# EAGLE design flightComputer (EAGLE 5.09)
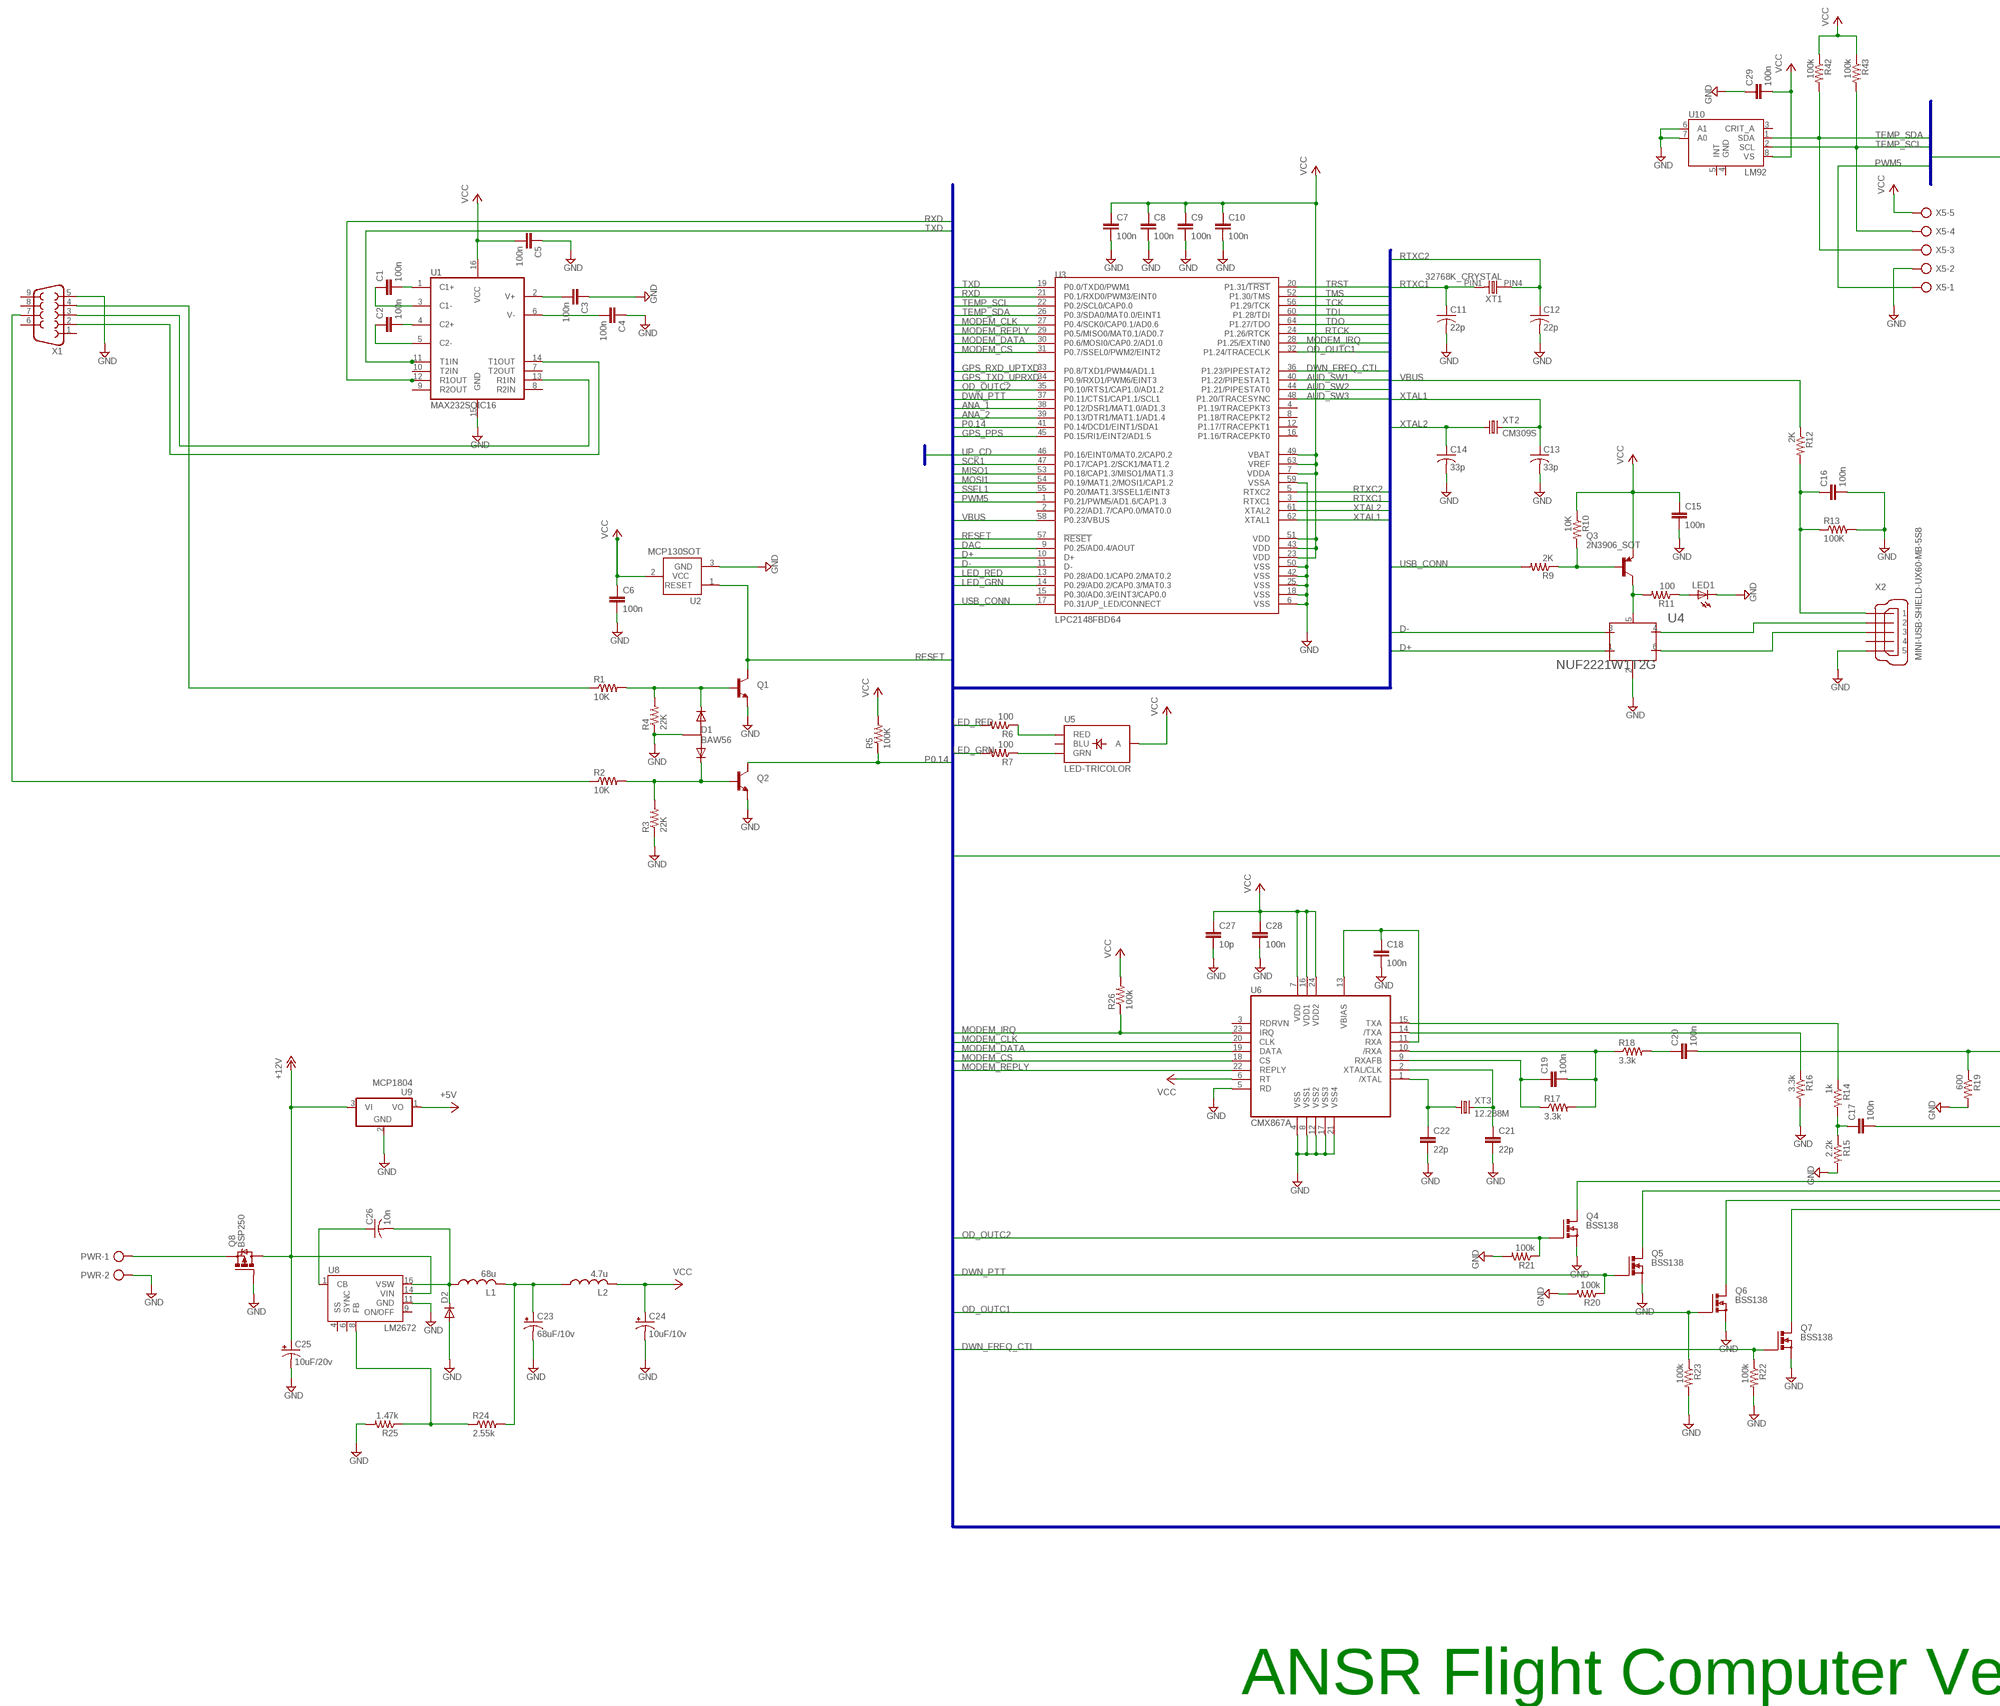
[diagram p0: schematic, sheet 1, part 1 of 2]
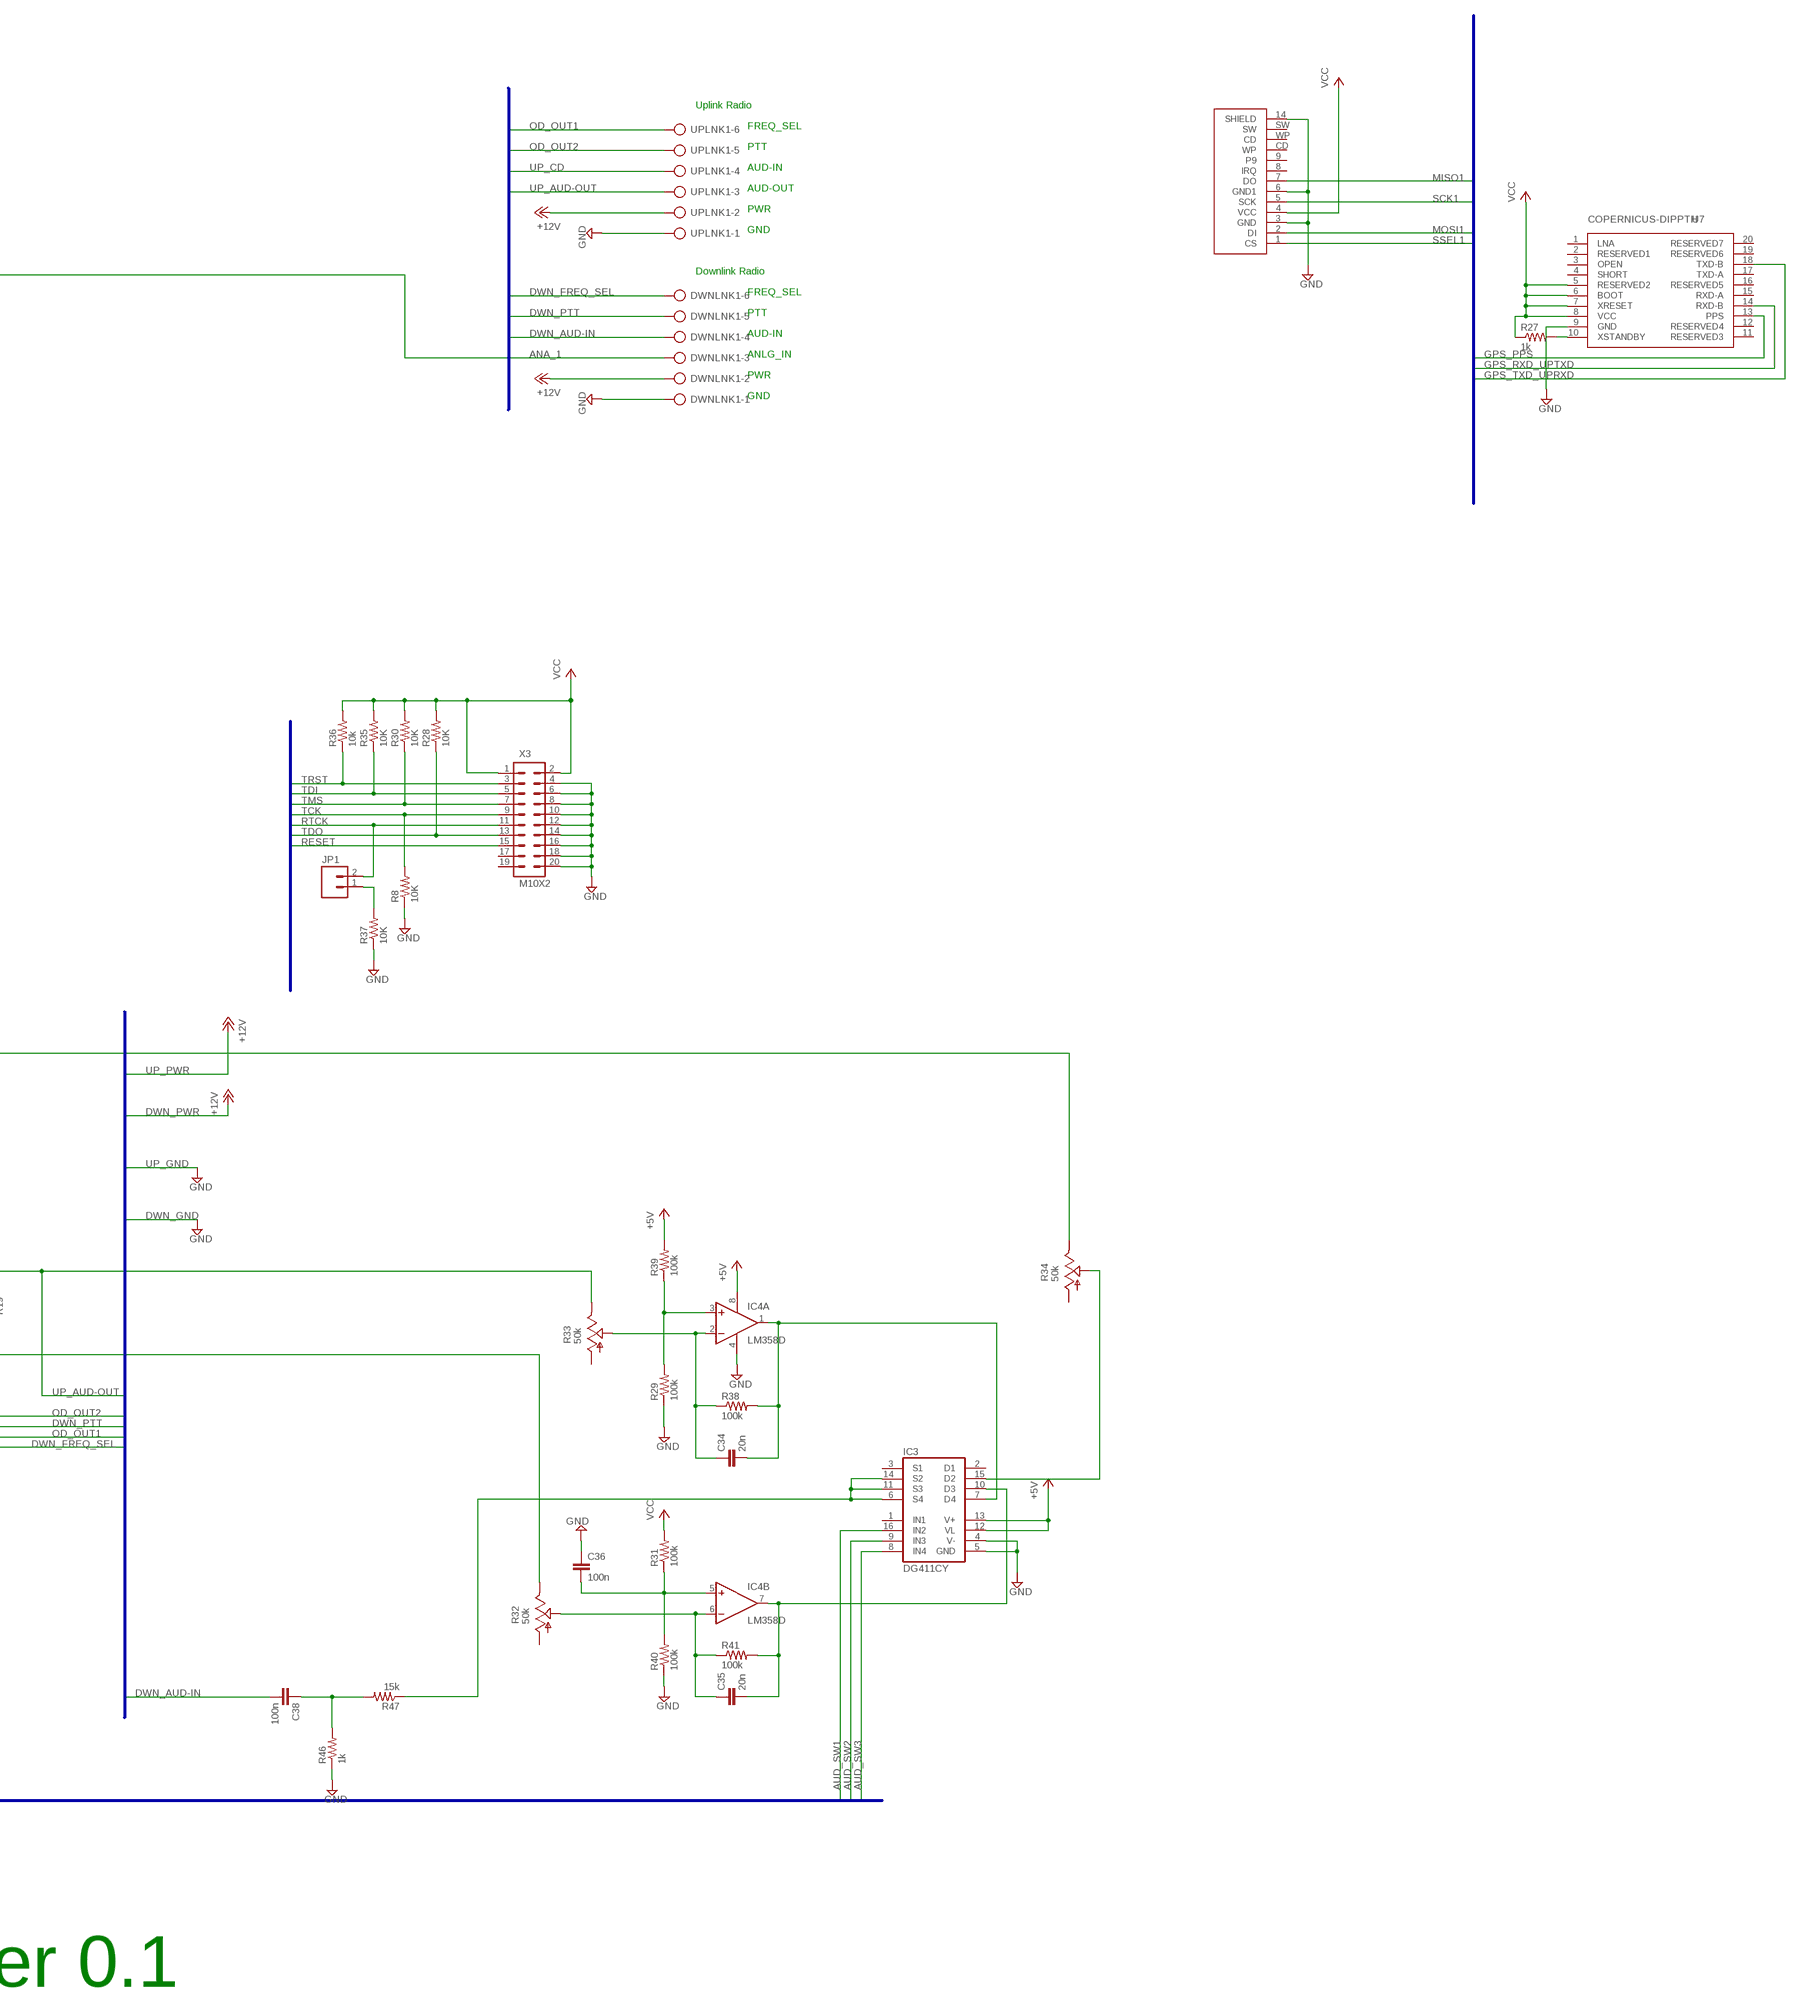
[diagram p1: schematic, sheet 1, part 2 of 2]

## Parts
C1  100n  C-EUC0402  [C0402]
C2  100n  C-EUC0402  [C0402]
C3  100n  C-EUC0402  [C0402]
C4  100n  C-EUC0402  [C0402]
C5  100n  C-EUC0402  [C0402]
C6  100n  C-EUC0402  [C0402]
C7  100n  C-EUC0402  [C0402]
C8  100n  C-EUC0402  [C0402]
C9  100n  C-EUC0402  [C0402]
C10  100n  C-EUC0402  [C0402]
C11  22p  C-USC0603  [C0603]
C12  22p  C-USC0603  [C0603]
C13  33p  C-USC0603  [C0603]
C14  33p  C-USC0603  [C0603]
C15  100n  C-EUC0402  [C0402]
C16  100n  C-EUC0402  [C0402]
C17  100n  C-EUC0402  [C0402]
C18  100n  C-EUC0402  [C0402]
C19  100n  C-EUC0402  [C0402]
C20  100n  C-EUC0402  [C0402]
C21  22p  C-EUC0402  [C0402]
C22  22p  C-EUC0402  [C0402]
C23  68uF/10v  CAP_POL7343  [EIA7343]
C24  10uF/10v  CAP_POL1206  [EIA3216]
C25  10uF/20v  CAP_POL3528  [EIA3528]
C26  10n  C-USC0603  [C0603]
C27  10p  C-EUC0402  [C0402]
C28  100n  C-EUC0402  [C0402]
C29  100n  C-EUC0402  [C0402]
C34  20n  C-EUC0402  [C0402]
C35  20n  C-EUC0402  [C0402]
C36  100n  C-EUC0402  [C0402]
C38  100n  C-EUC0402  [C0402]
D1  BAW56  [SOT23]
D2  DIODE-DO214AA  [DO214AA]
DWNLNK1  AK300/6  [AK300/6]
IC3  DG411CY  [SO16]
IC4  LM358D  [SO08]
JP1  M02  [1X02_LONGPADS]
L1  68u  COILCRAFTMSS7341  [MSS7341]
L2  4.7u  COILCRAFTLPS4018  [LPS4018]
LED1  LEDCHIP-LED0603  [CHIP-LED0603]
PWR  AK300/2  [AK300/2]
Q1  TRANSISTOR_NPNSOT23  [SOT23]
Q2  TRANSISTOR_NPNSOT23  [SOT23]
Q3  2N3906_SOT  [SOT23]
Q4  BSS138  [SOT23]
Q5  BSS138  [SOT23]
Q6  BSS138  [SOT23]
Q7  BSS138  [SOT23]
Q8  BSP250  [SOT223]
R1  10K  R-US_R0603  [R0603]
R2  10K  R-US_R0603  [R0603]
R3  22K  R-US_R0603  [R0603]
R4  22K  R-US_R0603  [R0603]
R5  100K  R-US_R0603  [R0603]
R6  100  R-US_R0603  [R0603]
R7  100  R-US_R0603  [R0603]
R8  10K  R-US_R0603  [R0603]
R9  2K  R-US_R0603  [R0603]
R10  10K  R-US_R0603  [R0603]
R11  100  R-US_R0603  [R0603]
R12  2K  R-US_R0603  [R0603]
R13  100K  R-US_R0603  [R0603]
R14  1k  R-US_R0603  [R0603]
R15  2.2k  R-US_R0603  [R0603]
R16  3.3k  R-US_R0603  [R0603]
R17  3.3k  R-US_R0603  [R0603]
R18  3.3k  R-US_R0603  [R0603]
R19  600  R-US_R0603  [R0603]
R20  100k  R-US_R0603  [R0603]
R21  100k  R-US_R0603  [R0603]
R22  100k  R-US_R0603  [R0603]
R23  100k  R-US_R0603  [R0603]
R24  2.55k  R-US_R0603  [R0603]
R25  1.47k  R-US_R0603  [R0603]
R26  100k  R-US_R0603  [R0603]
R27  1k  R-US_R0603  [R0603]
R28  10K  R-US_R0603  [R0603]
R29  100k  R-US_R0603  [R0603]
R30  10K  R-US_R0603  [R0603]
R31  100k  R-US_R0603  [R0603]
R32  50k  TRIM_US-CA6V  [CA6V]
R33  50k  TRIM_US-CA6V  [CA6V]
R34  50k  TRIM_US-CA6V  [CA6V]
R35  10K  R-US_R0603  [R0603]
R36  10k  R-US_R0603  [R0603]
R37  10K  R-US_R0603  [R0603]
R38  100k  R-US_R0603  [R0603]
R39  100k  R-US_R0603  [R0603]
R40  100k  R-US_R0603  [R0603]
R41  100k  R-US_R0603  [R0603]
R42  100k  R-US_R0603  [R0603]
R43  100k  R-US_R0603  [R0603]
R46  1k  R-US_R0603  [R0603]
R47  15k  R-US_R0603  [R0603]
U1  MAX232SOIC16  [SO016]
U2  MCP130SOT  [SOT23-3]
U3  LPC2148FBD64  [TSQFP50P1200X1200X160-64N]
U4  NUF2221W1T2G  [SOT363]
U5  LED-TRICOLOR  [LED-TRICOLOR-SMD]
U6  CMX867A  [TSSOP24]
U7  COPERNICUS-DIPPTH  [COPERNICUS-DIP]
U8  LM2672  [LLP-16]
U9  MCP1804  [SOT-223]
U10  LM92  [SO8]
U$3  SD_CARD_SOCKETSD  [SD-MMC_SOCKET-PP]
UPLNK1  AK300/6  [AK300/6]
X1  DB9  [DB9]
X2  MINI-USB-SHIELD-UX60-MB-5S8  [UX60-MB-5S8]
X3  M10X2  [2X10]
X5  AK300/5  [AK300/5]
XT1  32768K_CRYSTAL  [SMT_32768K]
XT2  CM309S  [CM309S]
XT3  12.288M  CM309S  [CM309S]

## Nets
+5V: IC3.12(VL) IC3.13(V+) IC4.8(P:V+) R39.2 U9.1(VO)
+12V: C25.A(+) DWNLNK1.2 Q8.2(D) U8.14(VIN) U9.3(VI) UPLNK1.2
ANA_1: DWNLNK1.3 U3.38(P0.12/DSR1/MAT1.0/AD1.3)
ANA_2: U3.39(P0.13/DTR1/MAT1.1/AD1.4)
AUD_SW1: IC3.16(IN2) U3.40(P1.22/PIPESTAT1)
AUD_SW2: IC3.9(IN3) U3.44(P1.21/PIPESTAT0)
AUD_SW3: IC3.8(IN4) U3.48(P1.20/TRACESYNC)
D+: U3.10(D+) U4.1(D1I)
D-: U3.11(D-) U4.3(D2I)
DAC: R34.E U3.9(P0.25/AD0.4/AOUT)
DWN_AUD-IN: C38.2 DWNLNK1.4
DWN_AUD-OUT: C35.1 IC4.6(B:-IN) R32.S R41.1
DWN_FREQ_CTL: Q7.1(G) R22.1 U3.36(P1.23/PIPESTAT2)
DWN_FREQ_SEL: DWNLNK1.6 Q7.3(D)
DWN_PTT: DWNLNK1.5 Q5.1(G) Q5.3(D) R20.1 U3.37(P0.11/CTS1/CAP1.1/SCL1)
GND: C3.1 C4.1 C5.1 C6.2 C7.2 C8.2 C9.2 C10.2 C11.2 C12.2 C13.2 C14.2 C15.2 C16.2 C18.2 C21.2 C22.2 C23.C(-) C24.C(-) C25.C(-) C27.2 C28.2 C29.1 C36.1 D1.3(GND) D2.A DWNLNK1.1 IC3.4(V-) IC3.5(GND) IC4.4(P:V-) LED1.C PWR.2 Q1.2(E) Q2.2(E) Q4.2(S) Q5.2(S) Q6.2(S) Q7.2(S) Q8.1(G) R3.1 R4.1 R8.1 R13.2 R15.2 R16.2 R19.2 R20.2 R21.2 R22.2 R23.2 R25.2 R29.1 R37.1 R40.1 R46.1 U1.15(GND) U2.3(GND) U3.6(VSS) U3.18(VSS) U3.25(VSS) U3.42(VSS) U3.50(VSS) U3.59(VSSA) U4.2(GND) U6.4(VSS) U6.5(RD) U6.8(VSS1) U6.12(VSS2) U6.17(VSS3) U6.21(VSS4) U7.9(GND) U8.11(GND) U9.2(ADJ) U10.6(A1) U10.7(A0) U$3.3(GND) U$3.6(GND1) U$3.14(SHIELD) UPLNK1.1 X1.5 X2.5 X3.4 X3.6 X3.8 X3.10 X3.12 X3.14 X3.16 X3.18 X3.20 X5.2
GPS_PPS: U3.45(P0.15/RI1/EINT2/AD1.5) U7.13(PPS)
GPS_RXD_UPTXD: U3.33(P0.8/TXD1/PWM4/AD1.1) U7.14(RXD-B)
GPS_TXD_UPRXD: U3.34(P0.9/RXD1/PWM6/EINT3) U7.18(TXD-B)
LED_GRN: R7.2 U3.14(P0.29/AD0.2/CAP0.3/MAT0.3)
LED_RED: R6.2 U3.13(P0.28/AD0.1/CAP0.2/MAT0.2)
MISO1: U3.53(P0.18/CAP1.3/MISO1/MAT1.3) U$3.7(DO)
MODEM_CLK: U3.27(P0.4/SCK0/CAP0.1/AD0.6) U6.20(CLK)
MODEM_CS: U3.31(P0.7/SSEL0/PWM2/EINT2) U6.18(CS)
MODEM_DATA: U3.30(P0.6/MOSI0/CAP0.2/AD1.0) U6.19(DATA)
MODEM_IRQ: R26.1 U3.28(P1.25/EXTIN0) U6.23(IRQ)
MODEM_REPLY: U3.29(P0.5/MISO0/MAT0.1/AD0.7) U6.22(REPLY)
MOSI1: U3.54(P0.19/MAT1.2/MOSI1/CAP1.2) U$3.2(DI)
N$1: R6.1 U5.R(RED)
N$2: R7.1 U5.G(GRN)
N$3: C1.2 U1.1(C1+)
N$4: C1.1 U1.3(C1-)
N$5: C2.2 U1.4(C2+)
N$6: C2.1 U1.5(C2-)
N$7: C3.2 U1.2(V+)
N$8: C4.2 U1.6(V-)
N$9: U1.14(T1OUT) X1.2
N$10: U1.13(R1IN) X1.3
N$11: JP1.1 R37.2
N$12: R1.1 X1.4
N$13: D1.1(D1) Q1.1(B) R1.2 R4.2
N$14: D1.2(D2) Q2.1(B) R2.2 R3.2
N$15: R2.1 X1.7
N$16: U4.4(D2C) X2.2
N$17: U4.6(D1C) X2.3
N$18: Q3.3(C) R11.2 U4.5(VBUS)
N$19: Q3.1(B) R9.1 R10.2
N$20: R14.1 U6.15(TXA)
N$21: LED1.A R11.1
N$22: C16.1 R12.2 R13.1 X2.1
N$23: R16.1 U6.14(/TXA)
N$24: C17.1 R14.2 R15.1
N$25: C18.1 U6.11(RXA) U6.13(VBIAS)
N$26: C19.2 R17.2 R18.1 U6.10(/RXA)
N$27: C19.1 R17.1 U6.9(RXAFB)
N$28: C20.1 R18.2
N$30: C22.1 U6.1(/XTAL) XT3.PIN1
N$31: C21.1 U6.2(XTAL/CLK) XT3.PIN4
N$33: R27.2 U7.10(XSTANDBY)
N$34: PWR.1 Q8.3(S)
N$35: C26.2 D2.C L1.1 U8.16(VSW)
N$36: C23.A(+) L1.2 L2.1 R24.2
N$37: C26.1 U8.1(CB)
N$38: R24.1 R25.1 U8.8(FB)
N$40: IC3.6(S4) IC3.11(S3) IC3.14(S2) R47.1
N$41: C17.2 R32.E
N$42: IC4.3(A:+IN) R29.2 R39.1
N$44: C34.2 IC3.7(D4) IC4.1(A:OUT) R38.2
N$45: IC3.15(D2) R34.S
N$47: C36.2 IC4.5(B:+IN) R31.1 R40.2
N$48: C35.2 IC3.10(D3) IC4.7(B:OUT) R41.2
N$50: C38.1 R46.2 R47.2
OD_OUT1: Q6.3(D) UPLNK1.6
OD_OUT2: Q4.3(D) UPLNK1.5
OD_OUTC1: Q6.1(G) R23.1 U3.32(P1.24/TRACECLK)
OD_OUTC2: Q4.1(G) R21.1 U3.35(P0.10/RTS1/CAP1.0/AD1.2)
P0.14: Q2.3(C) R5.1 U3.41(P0.14/DCD1/EINT1/SDA1)
PWM5: U3.1(P0.21/PWM5/AD1.6/CAP1.3) X5.1
RESET: Q1.3(C) U2.1(RESET) U3.57(!RESET) X3.15
RTCK: JP1.2 U3.24(P1.26/RTCK) X3.11
RTXC1: C11.1 U3.3(RTXC1) XT1.PIN1
RTXC2: C12.1 U3.5(RTXC2) XT1.PIN4
RXD: U1.12(R1OUT) U3.21(P0.1/RXD0/PWM3/EINT0)
SCK1: U3.47(P0.17/CAP1.2/SCK1/MAT1.2) U$3.5(SCK)
SSEL1: U3.55(P0.20/MAT1.3/SSEL1/EINT3) U$3.1(CS)
TCK: R8.2 U3.56(P1.29/TCK) X3.9
TDI: R35.1 U3.60(P1.28/TDI) X3.5
TDO: R28.1 U3.64(P1.27/TDO) X3.13
TEMP_SCL: R43.2 U3.22(P0.2/SCL0/CAP0.0) U10.2(SCL) X5.4
TEMP_SDA: R42.2 U3.26(P0.3/SDA0/MAT0.0/EINT1) U10.1(SDA) X5.3
TMS: R30.1 U3.52(P1.30/TMS) X3.7
TRST: R36.1 U3.20(P1.31/!TRST) X3.3
TXD: U1.11(T1IN) U3.19(P0.0/TXD0/PWM1)
UP_AUD-OUT: C20.2 C34.1 IC4.2(A:-IN) R19.1 R33.E R33.S R38.1 UPLNK1.3
UP_CD: U3.46(P0.16/EINT0/MAT0.2/CAP0.2) UPLNK1.4
USB_CONN: R9.2 U3.17(P0.31/UP_LED/CONNECT)
VBUS: R12.1 U3.58(P0.23/VBUS)
VCC: C5.2 C6.1 C7.1 C8.1 C9.1 C10.1 C15.1 C24.A(+) C27.1 C28.1 C29.2 L2.2 Q3.2(E) R5.2 R10.1 R26.2 R27.1 R28.2 R30.2 R31.2 R35.2 R36.2 R42.1 R43.1 U1.16(VCC) U2.2(VCC) U3.7(VDDA) U3.23(VDD) U3.43(VDD) U3.49(VBAT) U3.51(VDD) U3.63(VREF) U5.A U6.6(RT) U6.7(VDD) U6.16(VDD1) U6.24(VDD2) U7.5(RESERVED2) U7.6(BOOT) U7.7(XRESET) U7.8(VCC) U10.8(VS) U$3.4(VCC) X3.1 X3.2 X5.5
XTAL1: C13.1 U3.62(XTAL1) XT2.PIN4
XTAL2: C14.1 U3.61(XTAL2) XT2.PIN1
Unconnected: IC3.1(IN1) IC3.2(D1) IC3.3(S1) R32.A R33.A R34.A U1.7(T2OUT) U1.8(R2IN) U1.9(R2OUT) U1.10(T2IN) U3.2(P0.22/AD1.7/CAP0.0/MAT0.0) U3.4(P1.19/TRACEPKT3) U3.8(P1.18/TRACEPKT2) U3.12(P1.17/TRACEPKT1) U3.15(P0.30/AD0.3/EINT3/CAP0.0) U3.16(P1.16/TRACEPKT0) U5.B(BLU) U6.3(RDRVN) U7.1(LNA) U7.2(RESERVED1) U7.3(OPEN) U7.4(SHORT) U7.11(RESERVED3) U7.12(RESERVED4) U7.15(RXD-A) U7.16(RESERVED5) U7.17(TXD-A) U7.19(RESERVED6) U7.20(RESERVED7) U8.4(SS) U8.6(SYNC) U8.9(ON/OFF) U10.3(CRIT_A) U10.4(GND) U10.5(INT) U$3.8(IRQ) U$3.9 U$3.CD(WP) U$3.SW U$3.WP(CD) X1.1 X1.6 X1.8 X1.9 X2.4 X2.M1(S1) X2.M2(S2) X2.M3(S3) X2.M4(S4) X3.17 X3.19

## Buses
TXD,RXD,TEMP_SCL,TEMP_SDA,P0.14,LED_GRN,LED_RED,RESET,XTAL1,XTAL2,RTXC1,RTXC2,D+,D-,VBUS,USB_CONN,MODEM_IRQ,MODEM_CLK,MODEM_DATA,MODEM_CS,MODEM_REPLY,UP_PTT,DWN_PTT,UP_FREQ_CTL,DWN_FREQ_CTL,UP_PWR_CTL,DWN_PWR_CTL,GPS_TXD_UPRXD,GPS_RXD_UPTXD,GPS_PPS,SCK1,MISO1,MOSI1,SSEL1,DAC,AUD_SW1,AUD_SW2,AUD_SW3,TRST,TMS,TCK,TDI,TDO,RTCK,ANA_1,ANA_2,PWM5,OD_OUT2
UP_FREQ_SEL,UP_PTT,UP_AUD-IN,UP_AUD-OUT,UP_PWR,UP_GND,DWN_FREQ_SEL,DWN_PTT,DWN_AUD-IN,DWN_AUD-OUT,DWN_PWR,DWN_GND,MODEM_AUD_IN
UP_FREQ_SEL,UP_PTT,UP_CD,UP_AUD-OUT,UP_PWR,UP_GND,DWN_FREQ_SEL,DWN_PTT,DWN_AUD-IN,DWN_AUD-OUT,DWN_PWR,DWN_GND,MODEM_AUD_IN

## Notes on the sheet
- Uplink Radio
- FREQ_SEL
- PTT
- AUD-IN
- AUD-OUT
- PWR
- GND
- Downlink Radio
- FREQ_SEL
- PTT
- AUD-IN
- ANLG_IN
- PWR
- GND
- ANSR Flight Computer Ver 0.1

## Library data of the parts
C1-C10 C15-C22 C27-C29 C34-C36 C38 = rcl:C-EU: CAPACITOR, European symbol
C11-C14 C26 = rcl:C-US: CAPACITOR, American symbol
C23-C25 = SparkFun:CAP_POL: Capacitor Polarized These are standard SMD and PTH capacitors. Normally 10uF, 47uF, and 100uF in electrolytic and tantalum varieties. Always verify the external diameter of the through hole cap, it varies with capacity, voltage, and manufacturer. The EIA devices should be standard.
D1 = diode:BAW56
D2 = diode:DIODE-: DIODE
DWNLNK1 UPLNK1 = con-ptr500:AK300/6: CONNECTOR
IC3 = maxim:DG411CY: ANALOG SWITCH
IC4 = linear:LM358: OP AMP also LM158; LM258; LM2904 Source: http://cache.national.com/ds/LM/LM158.pdf
JP1 = SparkFun:M02: Header 2 Standard 2-pin 0.1" header. Use with straight break away headers (SKU : PRT-00116), right angle break away headers (PRT-00553), swiss pins (PRT-00743), machine pins (PRT-00117), and female headers (PRT-00115). Molex polarized connector foot print use with SKU : PRT-08233 with associated crimp pins and housings.
L1 = custom_Elijah:COILCRAFTMSS7341
L2 = custom_Elijah:COILCRAFTLPS4018
LED1 = led:LED: LED OSRAM: - CHIPLED LG R971, LG N971, LY N971, LG Q971, LY Q971, LO R971, LY R971 LH N974, LH R974 LS Q976, LO Q976, LY Q976 LO Q996 - Hyper CHIPLED LW Q18S LB Q993, LB Q99A, LB R99A - SideLED LS A670, LO A670, LY A670, LG A670, LP A670 LB A673, LV A673, LT A673, LW A673 LH A674 LY A675 LS A676, LA A676, LO A676, LY A676, LW A676 LS A679, LY A679, LG A679 - Hyper Micro SIDELED® LS Y876, LA Y876, LO Y876, LY Y876 LT Y87S - SmartLED LW L88C, LW L88S LB L89C, LB L89S, LG L890 LS L89K, LO L89K, LY L89K LS L896, LA L896, LO L896, LY L896 - TOPLED LS T670, LO T670, LY T670, LG T670, LP T670 LSG T670, LSP T670, LSY T670, LOP T670, LYG T670 LG T671, LOG T671, LSG T671 LB T673, LV T673, LT T673, LW T673 LH T674 LS T676, LA T676, LO T676, LY T676, LB T676, LH T676, LSB T676, LW T676 LB T67C, LV T67C, LT T67C, LS T67K, LO T67K, LY T67K, LW E67C LS E67B, LA E67B, LO E67B, LY E67B, LB E67C, LV E67C, LT E67C LW T67C LS T679, LY T679, LG T679 LS T770, LO T770, LY T770, LG T770, LP T770 LB T773, LV T773, LT T773, LW T773 LH T774 LS E675, LA E675, LY E675, LS T675 LS T776, LA T776, LO T776, LY T776, LB T776 LHGB T686 LT T68C, LB T68C - Hyper Mini TOPLED® LB M676 - Mini TOPLED Santana® LG M470 LS M47K, LO M47K, LY M47K Source: http://www.osram.convergy.de LUXEON: - LUMILED® LXK2-PW12-R00, LXK2-PW12-S00, LXK2-PW14-U00, LXK2-PW14-V00 LXK2-PM12-R00, LXK2-PM12-S00, LXK2-PM14-U00 LXK2-PE12-Q00, LXK2-PE12-R00, LXK2-PE12-S00, LXK2-PE14-T00, LXK2-PE14-U00 LXK2-PB12-K00, LXK2-PB12-L00, LXK2-PB12-M00, LXK2-PB14-N00, LXK2-PB14-P00, LXK2-PB14-Q00 LXK2-PR12-L00, LXK2-PR12-M00, LXK2-PR14-Q00, LXK2-PR14-R00 LXK2-PD12-Q00, LXK2-PD12-R00, LXK2-PD12-S00 LXK2-PH12-R00, LXK2-PH12-S00 LXK2-PL12-P00, LXK2-PL12-Q00, LXK2-PL12-R00 Source: www.luxeon.com KINGBRIGHT: KA-3528ASYC Source: www.kingbright.com
PWR = con-ptr500:AK300/2: CONNECTOR
Q1 Q2 = SparkFun:TRANSISTOR_NPN: Transistor NPN BJT configuration in SOT23 package. MMBT2222 is the common NPN we use. Double check BCE configuration again layout.
Q3 = transistor-pnp:2N3906_SOT
Q4-Q7 = transistor-power:BSS138
Q8 = transistor-power:BSP250
R1-R31 R35-R43 R46 R47 = rcl:R-US_: RESISTOR, American symbol
R32-R34 = pot:TRIM_US-: POTENTIOMETER
U1 = SparkFun:MAX232: RS232 Transceiver Very common IC. This is generically called 'MAX232', but works with the 3V equivalent MAX3232 generic ICs. Field tested and mother approved. Spark Fun Electronics SKU : COM-00316 (DIP) and COM-00589 (SMD)
U2 = SparkFun:MCP130
U3 = Philips_LPC2XXX:LPC2148
U4 = SparkFun:NUF2221W1T2G
U5 = SparkFun:LED-TRICOLOR: Tri-Color LED SMD Proven layout and schematic for triple color LED in SMD package - common anode. Spark Fun Electronics SKU : COM-07844
U6 = custom_Elijah:CMX867A: CML Micro's V.22 Modem with DTMF Decoding CMX867A
U7 = SparkFun:COPERNICUS-DIP
U8 = custom_Elijah:LM2672
U9 = custom_Elijah:MCP1804
U10 = custom_Elijah:LM92
U$3 = SparkFun:SD_CARD_SOCKET: SD/MMC Socket Media socket for SD and MMC cards. Push-push type. Schematic element and footprint production proven. Spark Fun Electronics SKU : PRT-00136
X1 = SparkFun:DB9: DB9 Connector Standard DB9 (D-Sub 9) serial connector. Can be used for CAN bus as well as RS485 and RS232. Footprint production proven. Spark Fun Electronics SKU : PRT-00429
X2 = con-hirose:MINI-USB-SHIELD-: MINI USB Connector Source: http://www.hirose.co.jp/cataloge_hp/e24000019.pdf
X3 = SparkFun:M10X2: This was SPECIALLY designed to be used with our Graphic LCD Backpack. Be sure you want to use this! It is not only staggered on each line of header holes, but IT IS ALSO offset of the center point of the top and bottom lines by 5 mil. This causes the headers to lock into place on the "standard" footprint on the LCD screen. The extra squares on the tdocu layer are there simply to reference other pins (if you were to actually populate a longer header than ten long - this is what we do with the backpacks).
X5 = con-ptr500:AK300/5: CONNECTOR
XT1 = crystal:32768K_CRYSTAL
XT2 XT3 = crystal:CM309S

## Board
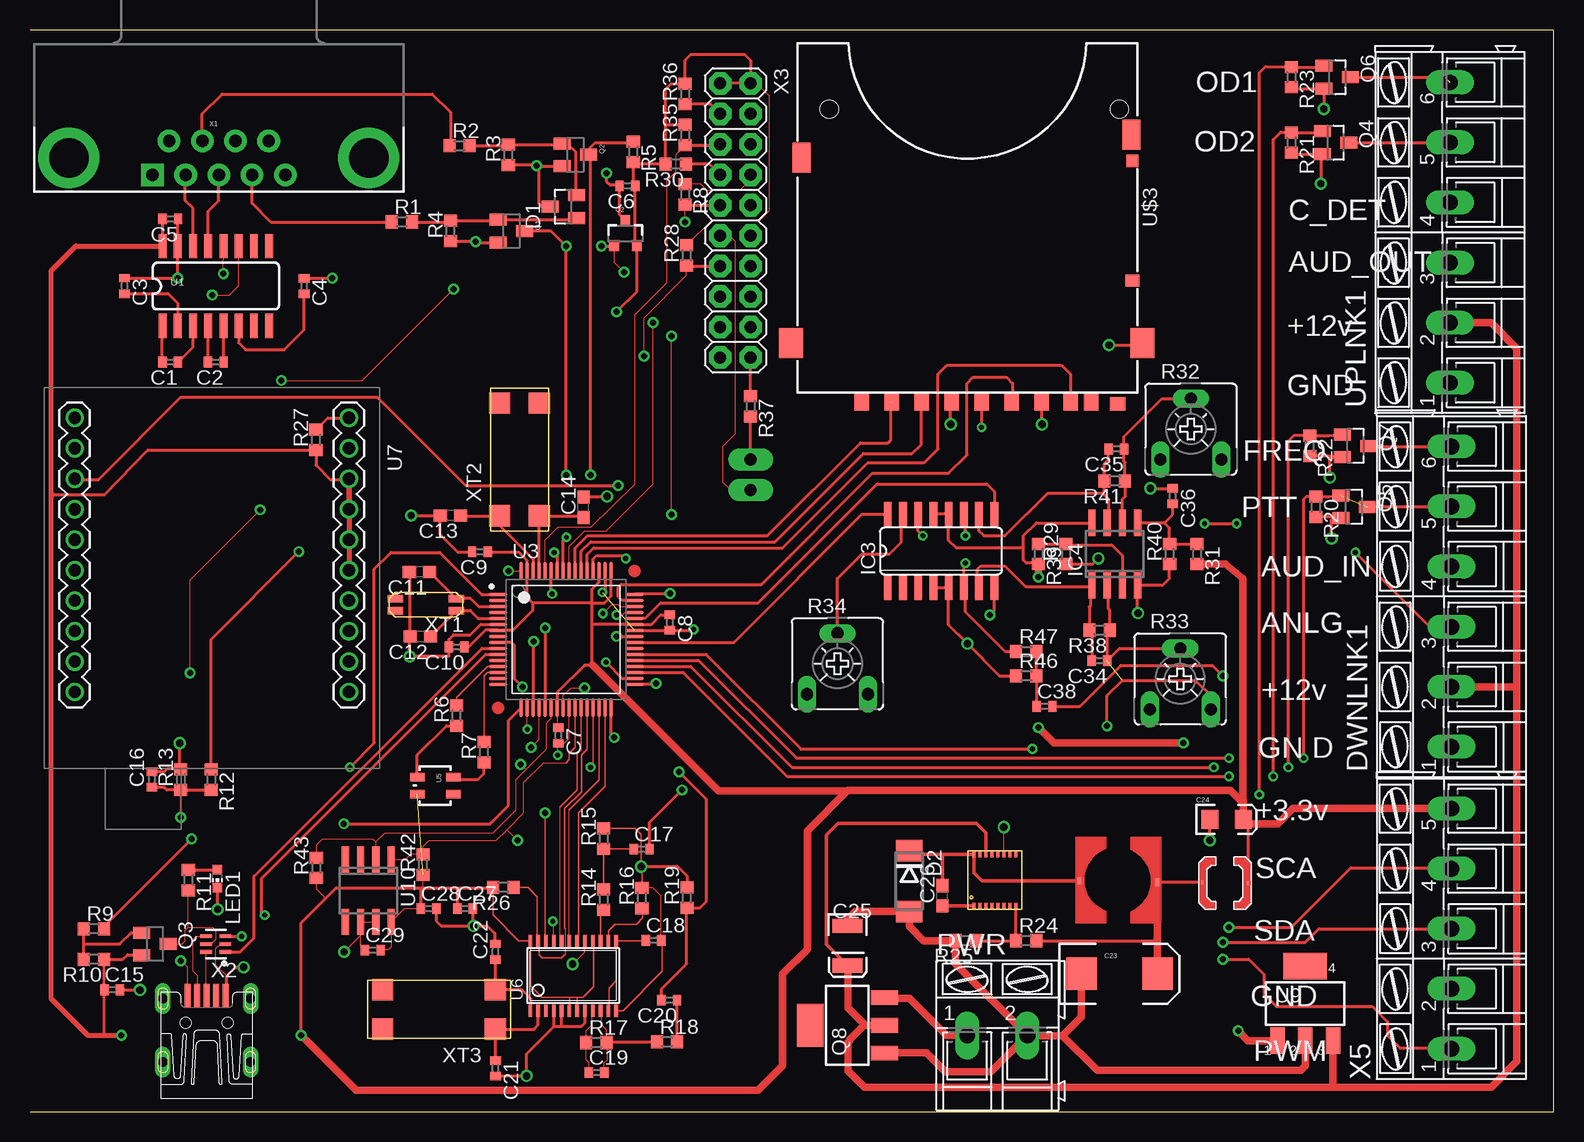
[diagram p2: board, top side]
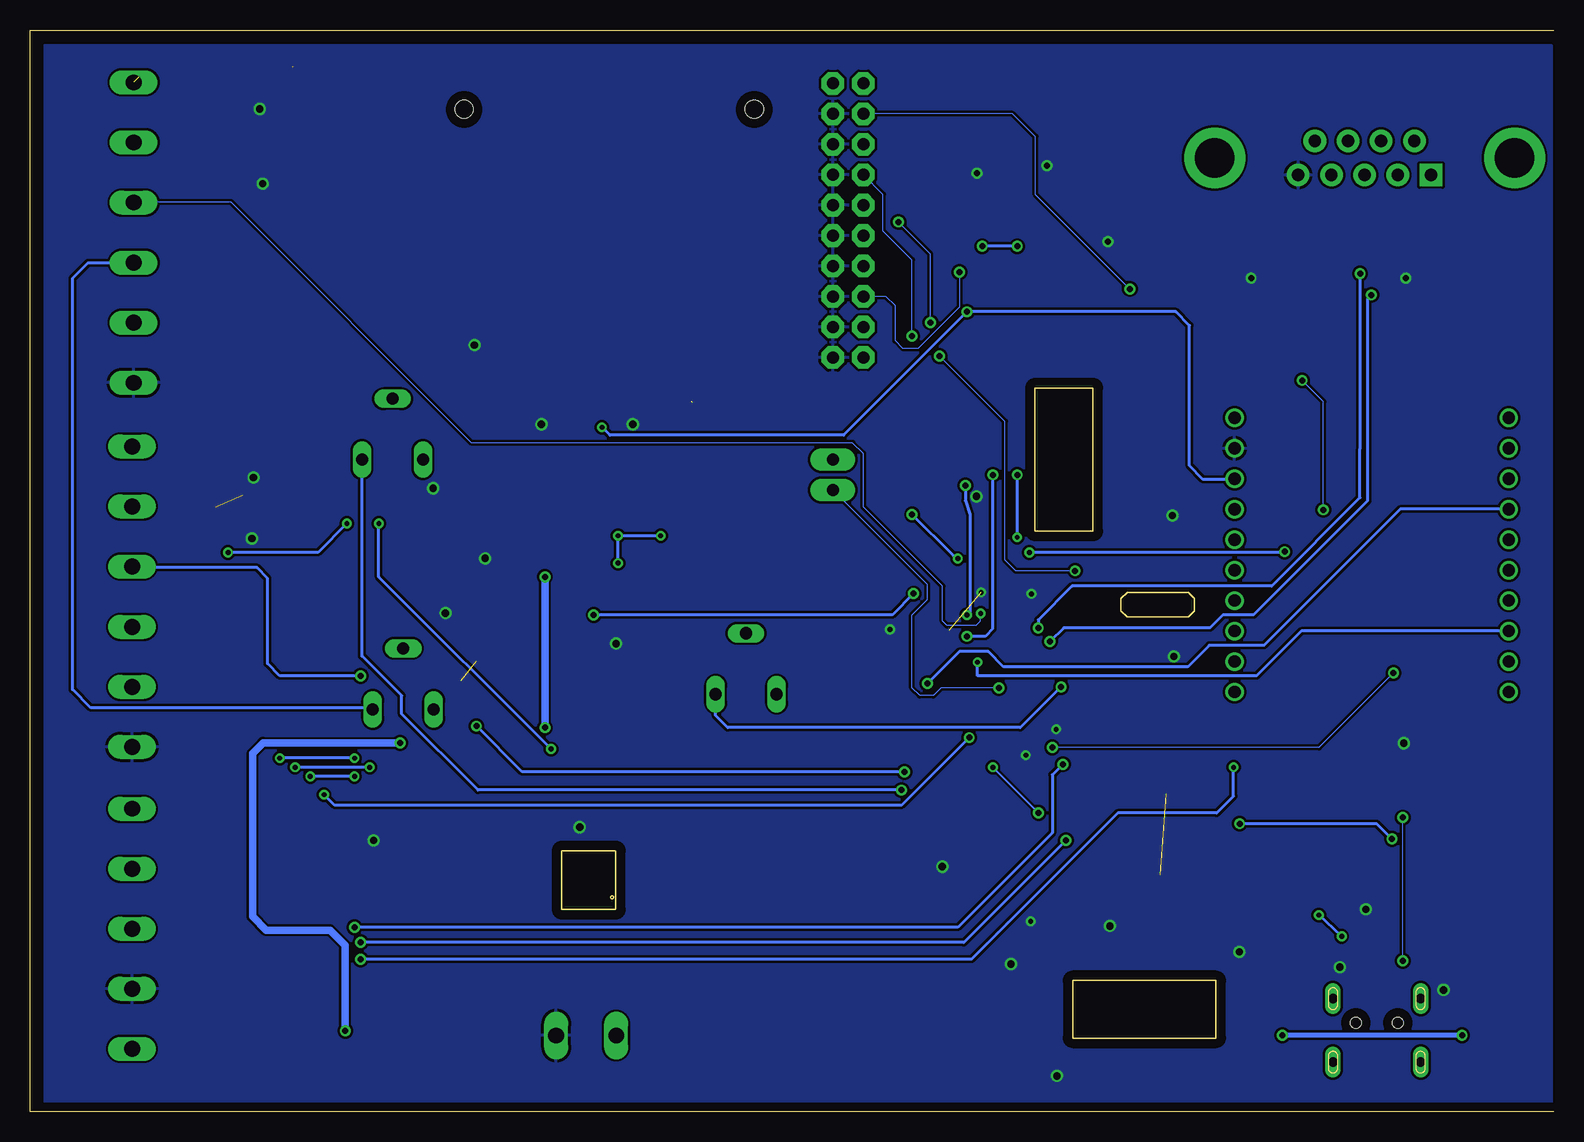
[diagram p3: board, bottom side, seen from below]

Size 127 x 90.17 mm. Coordinates in mm from the lower left corner, seen from the top.
Outline: 0,0 127,0 127,90.17 0,90.17
Copper layers (1*16): Top 0.035mm / dielectric 1.5mm / Bottom 0.035mm
Design rules "8mils *": minimum track width 3mil, minimum drill 0.6mm, track to track 8mil, track to pad 5mil, pad to pad 8mil, via to via 8mil, smd to smd 8mil, copper to edge 30mil, drill to drill 10mil, minimum pad ring 10mil, minimum via ring 8mil, stop-mask expansion 0mil, vias tented up to drill 0mil, thermal gap 10mil

### Footprints (pad centres in the part's own frame; a part is rotated, then mirrored left to right if it is on the bottom)
C0402 = smd 0.7 x 0.9: 1 -0.65,0; 2 0.65,0
C0603 = smd 1.1 x 1: 1 -0.85,0; 2 0.85,0
EIA7343 = smd 2.55 x 2.7: A 3.17,0; C -3.17,0
EIA3216 = smd 1.4 x 1.6: A 1.4,0; C -1.4,0
EIA3528 = smd 1.2 x 2.5: A 1.65,0; C -1.65,0
SOT23 = smd 1 x 1.4: 1 -0.95,-1.1; 2 0.95,-1.1; 3 0,1.1
DO214AA = smd 1.8 x 2.2: A 2.55,0; C -2.55,0
AK300/6 = drill 1.321 long: 1 -12.522,0; 2 -7.518,0; 3 -2.515,0; 4 2.515,0; 5 7.518,0; 6 12.522,0
SO16 = smd 0.66 x 2.032: 1 -4.445,-3.073; 2 -3.175,-3.073; 3 -1.905,-3.073; 4 -0.635,-3.073; 5 0.635,-3.073; 6 1.905,-3.073; 7 3.175,-3.073; 8 4.445,-3.073; 9 4.445,3.073; 10 3.175,3.073; 11 1.905,3.073; 12 0.635,3.073; 13 -0.635,3.073; 14 -1.905,3.073; 15 -3.175,3.073; 16 -4.445,3.073
SO08 = smd 0.6 x 2.2: 1 -1.905,-2.6; 2 -0.635,-2.6; 3 0.635,-2.6; 4 1.905,-2.6; 5 1.905,2.6; 6 0.635,2.6; 7 -0.635,2.6; 8 -1.905,2.6
1X02_LONGPADS = drill 1.016 pad 1.88 long: 1 0,0; 2 2.54,0
MSS7341 = smd 0.61 x 0.305: 1 -0.1,3.2; 2 -0.2,-3.3
LPS4018 = smd 0.152 x 0.305: 1 -1.8,0.2; 2 2,0.1
CHIP-LED0603 = smd 0.8 x 0.8: A 0,-0.75; C 0,0.75
AK300/2 = drill 1.321 long: 1 -2.515,0; 2 2.489,0
SOT223 = smd 1.219 x 2.235: 1 -2.311,-3.099; 2 0,-3.099; 3 2.311,-3.099 | smd 3.6 x 2.2: 4 0,3.099
R0603 = smd 1 x 1.1: 1 -0.85,0; 2 0.85,0
CA6V = drill 1.016 long: A -2.54,-2.54; E 2.54,-2.54; S 0,2.54
SO016 = smd 0.66 x 2.032: 1 -4.445,-3.315; 2 -3.175,-3.315; 3 -1.905,-3.315; 4 -0.635,-3.315; 5 0.635,-3.315; 6 1.905,-3.315; 7 3.175,-3.315; 8 4.445,-3.315; 9 4.445,3.315; 10 3.175,3.315; 11 1.905,3.315; 12 0.635,3.315; 13 -0.635,3.315; 14 -1.905,3.315; 15 -3.175,3.315; 16 -4.445,3.315
SOT23-3 = smd 0.8 x 0.9: 1 -0.95,-1; 2 0.95,-1; 3 0,1.1
TSQFP50P1200X1200X160-64N = smd 1.55 x 0.3: 1 -5.7,3.75; 2 -5.7,3.25; 3 -5.7,2.75; 4 -5.7,2.25; 5 -5.7,1.75; 6 -5.7,1.25; 7 -5.7,0.75; 8 -5.7,0.25; 9 -5.7,-0.25; 10 -5.7,-0.75; 11 -5.7,-1.25; 12 -5.7,-1.75; 13 -5.7,-2.25; 14 -5.7,-2.75; 15 -5.7,-3.25; 16 -5.7,-3.75; 33 5.7,-3.75; 34 5.7,-3.25; 35 5.7,-2.75; 36 5.7,-2.25; 37 5.7,-1.75; 38 5.7,-1.25; 39 5.7,-0.75; 40 5.7,-0.25; 41 5.7,0.25; 42 5.7,0.75; 43 5.7,1.25; 44 5.7,1.75; 45 5.7,2.25; 46 5.7,2.75; 47 5.7,3.25; 48 5.7,3.75 | smd 0.3 x 1.55: 17 -3.75,-5.7; 18 -3.25,-5.7; 19 -2.75,-5.7; 20 -2.25,-5.7; 21 -1.75,-5.7; 22 -1.25,-5.7; 23 -0.75,-5.7; 24 -0.25,-5.7; 25 0.25,-5.7; 26 0.75,-5.7; 27 1.25,-5.7; 28 1.75,-5.7; 29 2.25,-5.7; 30 2.75,-5.7; 31 3.25,-5.7; 32 3.75,-5.7; 49 3.75,5.7; 50 3.25,5.7; 51 2.75,5.7; 52 2.25,5.7; 53 1.75,5.7; 54 1.25,5.7; 55 0.75,5.7; 56 0.25,5.7; 57 -0.25,5.7; 58 -0.75,5.7; 59 -1.25,5.7; 60 -1.75,5.7; 61 -2.25,5.7; 62 -2.75,5.7; 63 -3.25,5.7; 64 -3.75,5.7
SOT363 = smd 0.3 x 0.99: 1 -0.65,-0.8; 2 0,-0.8; 3 0.65,-0.8; 4 0.65,0.81; 5 0,0.81; 6 -0.65,0.81
LED-TRICOLOR-SMD = smd 0.7 x 1.2: A 0.7,-1.5; B 0.7,1.5; G -0.7,1.5; R -0.7,-1.5
TSSOP24 = smd 0.305 x 0.991: 1 -3.575,-2.918; 2 -2.925,-2.918; 3 -2.275,-2.918; 4 -1.625,-2.918; 5 -0.975,-2.918; 6 -0.325,-2.918; 7 0.325,-2.918; 8 0.975,-2.918; 9 1.625,-2.918; 10 2.275,-2.918; 11 2.925,-2.918; 12 3.575,-2.918; 13 3.575,2.918; 14 2.925,2.918; 15 2.275,2.918; 16 1.625,2.918; 17 0.975,2.918; 18 0.325,2.918; 19 -0.325,2.918; 20 -0.975,2.918; 21 -1.625,2.918; 22 -2.275,2.918; 23 -2.925,2.918; 24 -3.575,2.918
COPERNICUS-DIP = drill 1.016 round: 1 0,0; 2 2.54,0; 3 5.08,0; 4 7.62,0; 5 10.16,0; 6 12.7,0; 7 15.24,0; 8 17.78,0; 9 20.32,0; 10 22.86,0; 11 22.86,22.86; 12 20.32,22.86; 13 17.78,22.86; 14 15.24,22.86; 15 12.7,22.86; 16 10.16,22.86; 17 7.62,22.86; 18 5.08,22.86; 19 2.54,22.86; 20 0,22.86
LLP-16 = smd 0.25 x 0.5: 1 0,0; 2 0.5,0; 3 1,0; 4 1.5,0; 5 2,0; 6 2.5,0; 7 3,0; 8 3.5,0; 9 3.5,4.3; 10 3,4.3; 11 2.5,4.3; 12 2,4.3; 13 1.5,4.3; 14 1,4.3; 15 0.5,4.3; 16 0,4.3
SOT-223 = smd 1.219 x 2.235: 1 -2.311,-3.099; 2 0,-3.099; 3 2.311,-3.099 | smd 3.6 x 2.2: 4 0,3.099
SO8 = smd 0.6 x 2.2: 1 -1.905,-2.6; 2 -0.635,-2.6; 3 0.635,-2.6; 4 1.905,-2.6; 5 1.905,2.6; 6 0.635,2.6; 7 -0.635,2.6; 8 -1.905,2.6
SD-MMC_SOCKET-PP = smd 1.2 x 1.5: 1 6.88,29.85; 2 4.38,29.85; 3 1.88,29.85; 4 -0.62,29.85; 5 -3.12,29.85; 6 -5.62,29.85; 7 -8.04,29.85; 8 -9.728,29.87; 9 9.38,29.85 | smd 1.5 x 2.5: 12 -13.1,7.6; 13 14.402,9.525 | smd 2 x 2.5: 14 -14,25; 15 15.3,25 | smd 1.15 x 1: CD -13.18,19.8 | smd 1.3 x 1.1: SW -11.938,30.048 | smd 1 x 1.05: WP -13.18,9.8 | hole 1.5: -12.1,5.5; 12.1,5.5
DB9 = drill 1.016 pad 1.88 square: 1 -5.54,-1.42 | drill 1.016 pad 1.88 round: 2 -2.77,-1.42; 3 0,-1.42; 4 2.77,-1.42; 5 5.54,-1.42; 6 -4.15,1.42; 7 -1.38,1.42; 8 1.38,1.42; 9 4.15,1.42 | drill 3.302 pad 5.08 round: G1 -12.5,0; G2 12.5,0
UX60-MB-5S8 = smd 2 x 0.5: 1 8.65,1.6; 2 8.65,0.8; 3 8.65,0; 4 8.65,-0.8; 5 8.65,-1.6 | drill 0.8 long: M1 3.1,-3.65; M2 3.1,3.65; M3 8.4,3.65; M4 8.4,-3.65 | hole 0.9: 6.4,-1.75; 6.4,1.75
2X10 = drill 1.016 pad 1.88 octagon: 1 -11.43,-1.27; 2 -11.43,1.27; 3 -8.89,-1.27; 4 -8.89,1.27; 5 -6.35,-1.27; 6 -6.35,1.27; 7 -3.81,-1.27; 8 -3.81,1.27; 9 -1.27,-1.27; 10 -1.27,1.27; 11 1.27,-1.27; 12 1.27,1.27; 13 3.81,-1.27; 14 3.81,1.27; 15 6.35,-1.27; 16 6.35,1.27; 17 8.89,-1.27; 18 8.89,1.27; 19 11.43,-1.27; 20 11.43,1.27
AK300/5 = drill 1.321 long: 1 -10.008,0; 2 -5.004,0; 3 0,0; 4 5.004,0; 5 10.008,0
SMT_32768K = smd 1.27 x 0.635: PIN1 -2.54,-0.508; PIN2 2.54,-0.508; PIN3 2.54,0.508; PIN4 -2.54,0.508
CM309S = smd 1.778 x 1.778: PIN1 -4.572,-1.778; PIN2 4.826,-1.778; PIN3 4.826,1.524; PIN4 -4.572,1.524

### Placement (x,y rotation side)
C1  11.68,62.48 180 top
C2  15.49,62.48 180 top
C3  7.87,68.83 270 top
C4  22.85,68.81 270 top
C5  11.7,74.41 180 top
C6  49.79,77.18 180 top
C7  44.04,31.34 270 top
C8  53.33,40.78 270 top
C9  37.5,46.66 180 top
C10  35.56,38.73 180 top
C11  32.47,44.98 180 top
C12  32.54,39.6 180 top
C13  35.05,49.7 180 top
C14  46.13,50.37 90 top
C15  6.86,10.16 0 top
C16  10.16,27.69 90 top
C17  51,21.87 0 top
C18  51.97,14.28 0 top
C19  47.22,3.25 0 top
C20  53.28,9.3 180 top
C21  38.8,3.62 270 top
C22  38.79,13.33 90 top
C23  90.82,11.49 0 top
C24  99.74,24.37 0 top
C25  68.16,13.83 270 top
C26  76.05,17.99 90 top
C27  36.27,16.92 0 top
C28  33.22,16.92 0 top
C29  28.57,13.46 0 top
C34  89.15,37.59 180 top
C35  90.55,55.24 180 top
C36  95.25,51.31 270 top
C38  84.58,33.78 0 top
D1  44.45,75.44 90 top
D2  73.29,19.22 270 top
DWNLNK1  118.49,42.93 90 top
IC3  75.95,46.74 0 top
IC4  90.42,46.48 0 top
JP1  60.07,54.36 270 top
L1  90.67,19.34 90 top
L2  99.52,18.94 0 top
LED1  15.62,19.43 180 top
PWR  80.64,6.34 0 top
Q1  40.13,73.41 270 top
Q2  45.47,79.76 270 top
Q3  10.41,13.97 270 top
Q4  108.84,80.77 270 top
Q5  110.36,50.42 270 top
Q6  108.97,86.23 270 top
Q7  110.49,55.5 270 top
Q8  68.12,7.19 90 top
R1  30.99,74.17 0 top
R2  35.81,80.52 0 top
R3  39.88,79.76 90 top
R4  35.05,73.41 90 top
R5  50.29,80.01 270 top
R6  35.56,33.02 90 top
R7  37.85,29.97 90 top
R8  54.61,76.45 270 top
R9  5.33,15.24 0 top
R10  5.33,12.7 180 top
R11  13.21,19.3 270 top
R12  15.11,27.69 270 top
R13  12.57,27.69 90 top
R14  47.82,17.68 90 top
R15  47.82,22.76 90 top
R16  51,17.81 90 top
R17  47.21,5.75 0 top
R18  53.1,5.82 0 top
R19  54.76,17.84 90 top
R20  107.19,50.42 270 top
R21  105.16,80.77 270 top
R22  106.68,55.5 270 top
R23  105.16,86.23 270 top
R24  83.04,14.25 0 top
R25  78,14.25 180 top
R26  39.44,18.7 180 top
R27  23.84,56.01 90 top
R28  54.74,71.37 90 top
R29  86.36,46.48 90 top
R30  53.85,78.99 180 top
R31  97.28,46.48 270 top
R32  96.77,56.9 0 top
R33  95.89,36.07 0 top
R34  67.31,37.34 0 top
R35  54.61,81.41 90 top
R36  54.61,84.84 90 top
R37  60.07,58.8 270 top
R38  89.15,40.13 180 top
R39  84.07,46.48 270 top
R40  95,46.48 90 top
R41  90.42,52.58 180 top
R42  32.77,20.57 90 top
R43  23.88,20.32 90 top
R46  83.06,36.32 0 top
R47  83.06,38.35 0 top
U1  15.49,68.83 0 top
U2  49.64,73.19 0 top
U3  44.7,39.37 0 top
U4  15.49,13.97 90 top
U5  33.78,27.18 270 top
U6  45.28,11.33 0 top
U7  26.59,34.98 90 top
U8  78.68,17.15 0 top
U9  106.3,9.02 0 top
U10  28.19,18.41 180 top
U$3  78.72,89.05 180 top
UPLNK1  118.36,73.28 90 top
X1  15.75,79.5 0 top
X2  14.73,1.02 90 top
X3  58.8,74.3 270 top
X5  118.49,15.24 90 top
XT1  33,42.26 180 top
XT2  40.67,54.24 90 top
XT3  34.22,8.4 180 top

### Tracks (layer width: path | path; a pad name or v marks a point on that pad's centre or on a via)
+5V  (via drill 0.5)
  Top 0.254: IC4.8 83.88,49.08 82.8,48.01 82.8,46.99 | 82.8,46.99 82.8,45.97 83.06,45.72 83.99,45.72 R39.2 | 82.8,46.99 77.22,46.99 76.58,47.62 IC3.12 IC3.13
  Top 0.61: U9.1 101.52,5.92 v100.71,6.73 | v84.07,32 85.34,30.73 v96.14,30.73 | v84.07,44.58 R39.2
  Bottom 0.61: v84.07,32 v84.07,44.58 | v100.71,6.73 100.71,13.84 101.98,15.11 107.31,15.11 108.46,16.26 108.46,29.84 107.57,30.73 v96.14,30.73
+12V
  Top 0.305: U8.14 79.68,23.24 78.89,24.03 67.35,24.03 66.4,23.08 66.4,13.94 C25.A
  Top 0.61: C25.A 68.17,12.17 68.17,8.67 69.66,7.18 | 69.66,7.18 69.51,7.18 68.34,6.01 68.34,5.94 68.19,5.79 68.19,3.42 69.58,2.03 108.71,2.03 | 69.66,7.18 Q8.2 | 108.71,2.03 121.79,2.03 123.95,4.19 123.95,35.18 | 123.95,35.18 123.95,63.63 121.79,65.79 118.39,65.79 UPLNK1.2 | DWNLNK1.2 123.72,35.41 123.95,35.18 | U9.3 108.61,2.13 108.71,2.03
ANA_1  (via drill 0.41)
  Top 0.254: U3.38 56.37,38.12 64.26,30.23 v83.57,30.23 | v97.92,49.02 v100.58,49.02 | v110.49,46.61 116.69,40.41 DWNLNK1.3
  Bottom 0.254: v83.57,30.23 97.92,44.58 v97.92,49.02 | v100.58,49.02 103,46.61 v110.49,46.61
AUD_SW1
  Top 0.254: IC3.16 69.37,49.81 58.67,39.12 U3.40
AUD_SW2
  Top 0.254: IC3.9 80.39,51.69 79.76,52.32 70.61,52.32 60.71,42.42 52.58,42.42 51.31,41.15 50.43,41.15 U3.44
AUD_SW3  (via drill 0.5 pad 0.25)
  Top 0.254: IC3.8 80.39,41.78 v80.01,41.4 | v53.34,43.18 50.46,43.18 U3.48
  Bottom 0.254: v80.01,41.4 55.12,41.4 v53.34,43.18
D+
  Top 0.254: U3.10 37.67,38.62 18.67,19.62 18.67,14.47 17.52,13.32 U4.1
D-  (via drill 0.41)
  Top 0.254: U3.11 37.99,38.12 19.3,19.43 19.3,16.64 v19.56,16.38 | v17.65,14.61 16.31,14.61 U4.3
  Bottom 0.254: v17.65,14.61 v19.56,16.38
DAC  (via drill 0.5)
  Top 0.254: U3.9 40.13,39.12 40.39,38.86 40.39,36.07 v41.05,35.41
  Bottom 0.254: v41.05,35.41 44.45,32 68.83,32 69.85,33.02 R34.E
DWN_AUD-IN  (via drill 0.5)
  Top 0.254: C38.2 87.5,33.78 90.93,37.21 98.55,37.21 v99.44,36.32
  Bottom 0.254: v99.44,36.32 106.17,36.32 107.19,37.34 107.19,44.45 108.08,45.34 118.39,45.34 DWNLNK1.4
DWN_AUD-OUT
  Top 0.254: IC4.6 91.06,51.05 91.31,51.31 91.31,52.54 R41.1 91.27,54.14 91.19,54.23 91.19,55.23 C35.1 91.2,56.28 94.36,59.44 R32.S
DWN_FREQ_CTL  (via drill 0.41)
  Top 0.254: U3.36 55.08,37.12 63.5,28.7 v98.68,28.7 | Q7.1 108.27,56.35 R22.1 106.64,56.39 105.41,56.39 104.9,55.88 v104.9,28.7
  Bottom 0.254: v98.68,28.7 v104.9,28.7
DWN_FREQ_SEL
  Top 0.254: DWNLNK1.6 111.64,55.45 Q7.3
DWN_PTT  (via drill 0.41)  (2 unrouted)
  Top 0.254: U3.37 55.73,37.62 63.88,29.46 v99.95,29.46 | 111.49,50.44 DWNLNK1.5 | Q5.1 108.27,51.27 R20.1 107.15,51.31 106.43,51.31 106.17,51.05 v106.17,29.46
  Bottom 0.254: v99.95,29.46 v106.17,29.46
GND  (via drill 0.41, 0.5 pad 0.25, 0.6)  (1 unrouted)
  Top 0.1: v41.45,31.87 U3.18 | U6.17 46.23,14.22 46.23,13.29 v45.24,12.29 | U4.2 15.88,13.97 15.49,13.59 15.49,12.19 16.38,11.3 | X2.5 16.38,9.72 | U6.21 43.66,15.78 v43.59,15.85 | 50.93,20.45 v50.95,20.42 51.01,20.36 | R16.2 51.01,18.67 51.94,18.67 52.62,17.99 C18.2 52.7,14.19 | U8.11 81.18,23.7 v81.17,23.71 | R8.1 54.65,77.34 55.88,77.34 56.39,76.83 59.18,76.83 60.07,77.72 X3.8 | U3.25 44.95,31.11 44.58,30.73 44.08,30.73 C7.2 43.99,30.65 v43.99,29.71 | U10.6 27.56,13.83 C29.1 | U10.6 27.56,14.68 v26.19,13.31 | U10.6 U10.7
  Top 0.127: R15.2 50.43,23.61 50.93,23.11 50.93,20.45 | 51.01,18.67 51.01,20.36 | U6.12 49.43,8.41 52.7,11.68 52.7,14.19
  Top 0.254: v31.77,49.69 C13.2 34.16,49.66 34.16,48.13 35.63,46.66 C9.2 | v25.2,69.47 22.86,69.47 C4.1 | C3.1 12.29,69.48 v12.3,69.47 12.3,72.13 U1.15 12.32,74.38 C5.1 | D2.A 73.3,16.66 | v98.34,22.61 C24.C | C21.2 v41.38,2.97 41.38,4.81 43.69,7.11 | R40.1 95,44.45 94.43,43.88 IC4.4 92.33,41.59 v92.37,41.55 | R29.1 88.58,45.63 v89.07,46.12 | R46.1 80.83,36.32 v78.14,39.01 76.58,40.57 IC3.5 IC3.4 | C36.1 v93.39,51.96 v93.38,51.96 | U3.42 50.41,40.13 C8.2 55.32,40.13 v55.32,40.18 | R4.1 37.11,72.56 v37.14,72.52 37.21,72.46 Q1.2 | R3.1 42.19,78.91 v42.22,78.87 | Q2.2 42.29,78.81 v42.22,78.87 | D1.3 42.67,75.44 42.42,75.69 42.42,78.68 v42.22,78.87 | v76.75,57.3 76.75,59.11 U$3.3 | v84.37,57.3 84.37,59.17 U$3.6 | v89.95,63.9 92.56,63.9 U$3.14 | 43.69,7.11 43.69,8.38 U6.4 | v48.06,78.24 48.06,77.54 48.39,77.22 49.1,77.22 C6.2 49.14,74.78 U2.3 | 48.01,45.12 U3.50 47.95,43.53 v47.71,43.29 | 16.38,9.72 16.38,11.3 17.12,12.04 v17.8,12.04 | C15.2 9.14,10.16 v9.17,10.14 | v15.64,16.87 15.64,18.66 LED1.C | C16.2 11.19,28.34 11.43,28.57 12.53,28.57 R13.2 12.47,28.64 v12.47,30.71 | U3.59 43.45,43.23 v43.52,43.16 | U6.8 46.26,7.4 45.97,7.11 44.32,7.11 | 43.69,7.11 44.32,7.11 | U6.5 44.31,7.13 44.32,7.11 | v36.98,15.47 38.12,15.47 38.73,14.86 38.73,14.04 C22.2 | v50.95,20.42 50.98,20.45 53.98,20.45 54.76,19.66 R19.2 | C27.2 36.92,15.53 v36.98,15.47 | C28.2 33.87,15.91 34.29,15.49 36.96,15.49 v36.98,15.47 | U3.6 37.57,40.62 36.7,39.75 35.31,39.75 34.92,39.37 34.92,38.75 C10.2 34.92,38.73 34.92,37.97 31.75,37.97 v31.65,37.95 31.65,39.56 C12.2 31.69,44.91 C11.2 | v48.09,51.29 46.2,51.29 C14.2 | R21.2 105.26,79.82 Q4.2 107.61,79.69 v107.61,77.36
  Top 0.254: R23.2 105.26,85.28 Q6.2 v107.86,83.59 | R22.2 108.27,54.65 Q7.2 108.37,54.55 v108.37,52.85 | v108.5,47.77 108.5,49.35 Q5.2 108.27,49.57 R20.2 | R37.1 X3.20
  Top 0.61: PWR.2 83.1,6.34 | C25.C 68.16,16.02 68.82,16.68 D2.A 73.29,15.43 74.48,14.24 R25.2 77.15,12.32 PWR.2 | C23.C 87.65,7.92 86.06,6.33 | 86.06,6.33 83.14,6.33 PWR.2 | Q8.1 74.73,4.88 76.29,3.32 80.11,3.32 PWR.2 | U9.2 106.3,3.81 105.92,3.43 88.97,3.43 86.06,6.33
  pour Bottom: 0.19,0.19 125.73,0.19 125.73,88.9 0.19,88.9
GPS_PPS  (via drill 0.41, 0.5)
  Top 0.1: v48.9,41.4 49.4,41.4 49.66,41.66 50.37,41.66 U3.45
  Top 0.254: v49.02,52.2 36.32,52.2 28.96,59.56 12.57,59.56 5.71,52.7 3.78,52.7 U7.13
  Bottom 0.254: v49.02,52.2 49.02,50.93 48.64,49.78 48.64,41.66 v48.9,41.4
GPS_RXD_UPTXD  (via drill 0.5)
  Top 0.254: U3.33 52.13,35.62 v52.2,35.69
  Bottom 0.254: U7.14 12.78,50.22 24.13,38.86 28.7,38.86 30.48,37.08 45.85,37.08 47.12,38.35 49.53,38.35 v52.2,35.69
GPS_TXD_UPRXD  (via drill 0.41)
  Top 0.254: U3.34 49.35,36.12 v48.01,37.47
  Bottom 0.254: U7.18 21.03,40.05 24.77,36.32 48.01,36.32 v48.01,37.47
LED_GRN
  Top 0.127: U3.14 38.14,36.62 37.85,36.32 R7.2
LED_RED
  Top 0.127: U3.13 38.14,37.12 35.56,34.54 R6.2
MISO1
  Top 0.254: U3.53 46.45,46.45 46.99,46.99 62.74,46.99 69.85,54.1 74.55,54.1 75.69,55.24 75.69,61.47 76.45,62.23 85.98,62.23 86.74,61.47 86.74,59.22 U$3.7
MODEM_CLK
  Top 0.1: U6.20 44.2,14.39
  Top 0.102: 44.2,14.39 44.2,25.4
  Top 0.127: U3.27 45.95,30.21 45.59,29.84 45.59,26.8 44.2,25.4
MODEM_CS
  Top 0.1: U6.18 45.72,14.36
  Top 0.127: U3.31 47.95,27.13 45.72,24.89 45.72,14.36
MODEM_DATA
  Top 0.102: U6.19 44.96,25.15
  Top 0.127: U3.30 47.45,27.64 44.96,25.15
  Top 0.254: U6.19
MODEM_IRQ
  Top 0.1: 42.42,14.19 U6.23 42.29,14.32
  Top 0.102: 44.63,13.13 44.63,15.24
  Top 0.127: U3.28 46.45,30.2 45.97,29.72 45.97,26.67 44.58,25.27 44.58,15.29 44.63,15.24 | 42.42,14.19 42.42,13.08 42.67,12.83 44.32,12.83 44.63,13.13 | R26.1 41.5,18.7 42.29,17.91 42.29,14.32
MODEM_REPLY  (via drill 0.41, 0.5)
  Top 0.1: U6.22 42.93,14.33
  Top 0.127: U3.29 46.95,28.92 v46.74,28.7 | 42.93,14.33 v42.93,24.89
  Bottom 0.127: v42.93,24.89 v46.74,28.7
MOSI1
  Top 0.254: U3.54 45.95,46.72 46.74,47.5 62.1,47.5 69.47,54.86 73.53,54.86 74.3,55.63 74.3,59.16 U$3.2
N$1
  Top 0.254: R6.1 34.71,32.17 32.26,29.72 32.26,27.9 U5.R
N$2
  Top 0.254: R7.1 37.85,28.19 37.34,27.69 35.47,27.69 U5.G
N$3
  Top 0.254: C1.2 11.03,65.5 U1.1
N$4
  Top 0.254: U1.3 13.59,63.74 C1.1
N$5
  Top 0.254: C2.2 14.84,65.5 U1.4
N$6
  Top 0.254: U1.5 16.13,62.5 C2.1
N$7
  Top 0.254: U1.2 12.32,67.38 11.5,68.19 7.88,68.19 C3.2
N$8
  Top 0.254: C4.2 22.85,65.18 21.19,63.52 17.97,63.52 17.39,64.1 U1.6
N$9
  Top 0.254: U1.14 13.59,75.31 12.95,75.95 12.95,78.06 X1.2
N$10
  Top 0.254: U1.13 14.86,75.06 15.75,75.95 X1.3
N$11
  Top 0.254: JP1.1 R37.2
N$12
  Top 0.254: X1.4 18.52,75.72 20.07,74.17 R1.1
N$13
  Top 0.254: R1.2 34.96,74.17 R4.2 38.93,74.26 Q1.1 45.42,74.36 D1.1
N$14
  Top 0.254: R2.2 39.79,80.52 R3.2 44.27,80.61 Q2.1 44.77,80.71 45.47,80.01 45.47,76.47 D1.2
N$15
  Top 0.254: X1.7 14.37,83.2 16,84.84 33.53,84.84 35.05,83.31 35.05,80.61 R2.1
N$16
  Top 0.1: U4.4 13.86,14.62 13.59,14.35 13.59,11.68 13.97,11.3 13.97,9.7 X2.2
N$17
  Top 0.1: U4.6 14.68,9.71 X2.3
N$18
  Top 0.1: U4.5 15.11,13.97 15.49,14.35 15.49,15.11 15.24,15.37 13.21,15.37 | 13.21,15.37 12.95,15.11 12.95,14.22 12.7,13.97 Q3.3 | 13.21,15.37 R11.2
N$19
  Top 0.254: R10.2 4.48,13.84 | 4.48,13.84 R9.1 | Q3.1 8.44,14.92 7.49,13.97 4.61,13.97 4.48,13.84
N$20
  Top 0.1: 47.56,16.57 R14.1
  Top 0.127: U6.15 47.56,16.57
N$21
  Top 0.254: R11.1 15.59,20.15 LED1.A
N$22  (via drill 0.5)
  Top 0.1: X2.1 13.13,12.01 v12.57,12.57 | v12.57,24.51 R13.1
  Top 0.254: C16.1 11.19,27.04 11.43,26.8 12.53,26.8 R13.1 R12.2
  Bottom 0.1: v12.57,12.57 v12.57,24.51
N$23
  Top 0.1: 51.05,16.9 R16.1
  Top 0.127: U6.14 48.21,15.06 48.77,15.62 50.55,15.62 51.05,16.13 51.05,16.9
N$24
  Top 0.1: 50.31,21.91 C17.1
  Top 0.127: R14.2 R15.1 50.31,21.91
N$25
  Top 0.1: U6.11 48.26,8.46 | 51.29,14.25 C18.1
  Top 0.127: 48.26,8.46 48.26,10.29 48.86,10.89 U6.13 51.29,14.25
N$26
  Top 0.1: U6.10 47.62,8.35 47.62,7.24 48.06,6.81 R17.2 48.13,5.67 48.13,4.32 47.87,4.06 C19.2
  Top 0.254: R18.1 48.13,5.82 R17.2
N$27
  Top 0.1: U6.9 46.86,8.37 46.86,7.24 46.36,6.73 R17.1 46.36,4.32 46.61,4.06 46.61,3.29 C19.1
N$28
  Top 0.254: R18.2 53.95,9.28 C20.1
N$30
  Top 0.254: U6.1 41.71,9.44 40.98,10.18 XT3.PIN1 C22.1
N$31
  Top 0.254: U6.2 42.35,7.23 42,6.88 XT3.PIN4 C21.1
N$33
  Top 0.254: U7.10 24.81,57.84 R27.2
N$34
  Top 0.61: PWR.1 76.39,6.34 73.3,9.43 71.29,9.43 Q8.3
N$35
  Top 0.305: 75.99,21.45 73.61,21.45 D2.C | 75.99,21.45 U8.16 78.68,19.88 79.34,19.22 87.45,19.22 L1.1 | C26.2 76.05,21.39 75.99,21.45
N$36
  Top 0.254: L1.2 L2.1 | R24.2 93.89,14.25
  Top 0.61: 93.99,14.35 C23.A | 93.99,14.35 93.99,19.12 L1.2 | 93.89,14.25 93.99,14.35
N$37
  Top 0.305: C26.1 U8.1
N$38
  Top 0.254: R25.1 R24.1 82.19,17.14 U8.8
N$40  (via drill 0.41)
  Top 0.254: R47.1 81.28,38.35 77.98,41.66 77.98,43.54 IC3.6 77.85,45.59 v77.98,45.72 | IC3.11 77.98,49.68 v77.98,48.01 | 73.91,49.94 IC3.14 74.04,48.39 v74.42,48.01
  Bottom 0.254: v77.98,45.72 v77.98,48.01 v74.42,48.01
N$41  (via drill 0.5)
  Top 0.254: C17.2 51.65,24.09 v54.36,26.8
  Bottom 0.254: v54.36,26.8 89.66,26.8 96.01,33.15 96.01,34.67 99.31,37.97 R32.E
N$42
  Top 0.254: IC4.3 91.06,46.35 90.17,47.24 86.45,47.24 R29.2 R39.1
N$44
  Top 0.254: C34.2 88.5,40.13 R38.2 88.3,42.08 88.39,42.16 88.39,43.76 | 88.39,43.76 IC4.1 | 88.39,43.76 82.99,43.76 81.28,45.47 79.25,45.47 78.99,45.21 78.99,43.79 IC3.7
N$45
  Top 0.254: R34.S 67.31,44.45 69.34,46.48 71.63,46.48 72.64,47.5 72.64,49.68 IC3.15
N$47
  Top 0.254: 94.55,49.08 IC4.5 | 94.55,49.08 95.25,49.78 C36.2 | 94.55,49.08 95,48.63 R40.2 R31.1
N$48
  Top 0.254: IC3.10 79.12,48.39 79.5,48.01 81.28,48.01 84.84,51.56 89.41,51.56 | 89.41,51.56 89.92,51.05 89.92,49.21 IC4.7 | 89.41,51.56 89.57,51.73 R41.2 89.57,54.01 89.92,54.36 89.92,55.23 C35.2
N$50
  Top 0.254: C38.1 83.93,36.3 R46.2 R47.2
OD_OUT1  (1 unrouted)
  Top 0.254: Q6.3 117.93,86.23
OD_OUT2
  Top 0.254: 109.96,80.8 Q4.3 118.34,80.77 UPLNK1.5
OD_OUTC1  (via drill 0.41, 0.5)  (1 unrouted)
  Top 0.254: R23.1 107.77,87.08 Q6.1 | U3.32 48.45,31.43 v48.71,31.18 | 105.12,87.12 103,87.12 102.49,86.61 v102.49,26.42
  Bottom 0.254: v48.71,31.18 54.36,25.53 101.6,25.53 v102.49,26.42
OD_OUTC2  (via drill 0.41)
  Top 0.254: v99.95,27.94 63.12,27.94 54.44,36.62 U3.35 | Q4.1 107.64,81.62 R21.1 105.12,81.66 104.27,81.66 103.63,81.03 v103.63,27.94
  Bottom 0.254: v99.95,27.94 v103.63,27.94
P0.14  (via drill 0.5)
  Top 0.254: R5.1 50.2,80.77 47.12,80.77 46.57,80.22 Q2.3 46.74,79.59 v46.74,53.09 | U3.41 v48.9,39.62
  Bottom 0.254: v48.9,39.62 47.37,39.62 46.74,40.26 v46.74,53.09
PWM5  (via drill 0.41, 0.5)
  Top 0.254: U3.1 37.65,43.12 34.16,46.61 30.1,46.61 28.7,45.21 28.7,30.73 v26.67,28.7 | v99.44,12.7 101.6,12.7 102.87,11.43 102.87,9.78 103.89,8.76 111.89,8.76 113.16,7.49 113.16,6.35 114.17,5.33 118.39,5.33 X5.1
  Bottom 0.254: v26.67,28.7 26.67,26.29 28.07,24.89 36.32,24.89 48.51,12.7 v99.44,12.7
RESET  (via drill 0.41, 0.5)
  Top 0.1: U2.1 48.69,70.82 v49.53,69.98
  Top 0.254: Q1.3 43.43,73.41 v44.7,72.14 v44.7,53.09 | v47.62,72.14 48.63,72.14 U2.1 | v44.7,47.88 44.45,47.62 U3.57
  Bottom 0.1: v49.53,69.98 49.53,67.06 52.96,63.63 54.23,63.63 54.86,64.26 54.86,67.18 55.63,67.94 X3.15
  Bottom 0.254: v44.7,72.14 v47.62,72.14 | v44.7,47.88 v44.7,53.09
RTCK  (via drill 0.5)
  Top 0.1: X3.11 58.29,73.03 58.8,72.52 58.8,56.52 57.78,55.5 57.78,52.45 58.42,51.82 JP1.2 | U3.24 44.45,34.67 45.09,35.31 v46.23,35.31
  Bottom 0.1: v46.23,35.31 51.05,35.31 51.69,34.67 52.83,34.67 53.47,35.31 53.47,41.4 52.2,42.67 52.2,43.94 JP1.2
RTXC1
  Top 0.254: U3.3 37.38,42.12 36.7,42.8 35.57,42.8 XT1.PIN1 C11.1
RTXC2
  Top 0.254: U3.5 37.37,41.12 36.7,41.78 35.57,41.78 XT1.PIN4 C12.1
RXD  (via drill 0.5)
  Top 0.1: v16.12,69.85 U1.12
  Top 0.254: v42.95,40.31 U3.21
  Bottom 0.254: v16.12,69.85 16.12,55.25 16.13,55.24 16.13,51.18 23.5,43.81 40.13,43.81 42.95,40.99 v42.95,40.31
SCK1
  Top 0.254: U3.47 49.33,42.62 49.02,42.93 49.02,43.69 49.28,43.94 60.96,43.94 70.23,53.21 76.58,53.21 78.11,54.74 78.11,60.71 78.61,61.21 81.41,61.21 81.92,60.71 81.92,59.28 U$3.5
SSEL1  (1 unrouted)
  Top 0.254: U3.55 45.45,46.98 46.48,48.01 61.47,48.01 69.22,55.75 71.5,55.75 71.75,56.01 71.75,59.12
TCK  (via drill 0.5)
  Top 0.1: U3.56 44.95,47.11 46.23,48.39 48.01,48.39 51.94,52.32 v51.94,65.79 | v54.61,74.17 R8.2
  Top 0.254: X3.9 54.65,75.56 R8.2
  Bottom 0.1: v51.94,65.79 51.94,71.5 v54.61,74.17
TDI
  Top 0.1: U3.60 42.95,47.65 44.02,48.72 46.79,48.72 50.42,52.32 50.42,66.42 53.09,69.09 53.09,77.6 53.85,78.36 53.85,79.8 R35.1
  Top 0.254: R35.1 57.44,80.56 X3.5
TDO  (via drill 0.5)
  Top 0.1: U3.64 39.89,45.07 v39.88,45.09 | v51.18,62.99 51.18,66.17 54.74,69.72 R28.1
  Top 0.254: X3.13 54.78,70.48 R28.1
  Bottom 0.1: v39.88,45.09 44.83,45.09 45.72,45.97 45.72,57.53 v51.18,62.99
TEMP_SCL  (via drill 0.5)
  Top 0.1: U3.22 43.45,32.79 43.05,32.38 43.05,30.23 41.34,28.51 | 41.34,28.51 40.51,27.69 40.51,25.15 38.61,23.24 29.59,23.24 28.83,22.48 | 28.83,22.48 U10.2 | R43.2 23.88,22.23 24.38,22.73 28.57,22.73 28.83,22.48 | 41.34,28.51 v40.89,28.96
  Top 0.254: v99.95,15.37 105.16,15.37 110.11,20.32 118.42,20.32 X5.4
  Bottom 0.254: v99.95,15.37 49.66,15.37 41.78,23.24 41.78,28.07 v40.89,28.96
TEMP_SDA  (via drill 0.5)
  Top 0.1: 44.7,29.08 42.8,29.08 41.15,27.43 41.15,24.89 39.75,23.5 | 39.75,23.5 38.86,22.61 33.27,22.61 32.77,22.1 R42.2 32.73,21.46 31.75,21.46 31.3,21.02 U10.1 | 39.75,23.5 v40.64,22.61
  Top 0.127: U3.26 45.45,30.34 44.96,29.84 44.96,29.34 44.7,29.08
  Top 0.254: X5.3 107.44,15.24 106.3,14.1 v99.44,14.1
  Bottom 0.254: v99.44,14.1 49.15,14.1 v40.64,22.61
TMS  (via drill 0.41, 0.5)
  Top 0.1: v53.47,49.78 v53.47,64.64
  Top 0.254: R30.1 56.64,78.99 X3.7 | U3.52 46.95,46.06 47.24,46.35 49.4,46.35 v49.66,46.1
  Bottom 0.1: v53.47,64.64 53.47,70.99 55.88,73.41 55.88,76.45 X3.7
  Bottom 0.254: v49.66,46.1 50.04,46.35 v53.47,49.78
TRST  (via drill 0.5)
  Top 0.1: v35.31,68.58 27.69,60.96 v20.95,60.96 | v19.18,50.16 13.34,44.32 v13.34,36.58 | v41.78,30.35 42.45,31.02 U3.20
  Top 0.254: R36.1 56.73,83.99 X3.3
  Bottom 0.1: X3.3 45.09,83.19 43.18,81.28 43.18,76.45 v35.31,68.58 | v20.95,60.96 19.18,59.18 v19.18,50.16 | v13.34,36.58 19.56,30.35 v41.78,30.35
TXD  (via drill 0.5)
  Top 0.1: v15.18,68.08 16.62,68.08 17.38,68.84 17.38,72.13 U1.11
  Top 0.254: U3.19 41.95,39.16 v41.97,39.18
  Bottom 0.254: v15.18,68.08 15.49,67.77 15.49,50.93 25.02,41.4 27.56,41.4 28.63,40.33 40.83,40.33 v41.97,39.18
UP_AUD-OUT  (via drill 0.5)  (1 unrouted)
  Top 0.254: C34.1 89.8,40.13 R38.1 90,41.82 89.92,41.91 89.92,43.76 IC4.2 | C20.2 52.63,10.22 54.74,12.32 54.74,16.96 R19.1 55.85,16.98 56.39,17.53 56.39,26.04 v54.1,28.32 | C34.1 89.79,37.58 | R33.S 90.82,38.61 C34.1 | R33.E 98.42,34.67 97.16,35.94 91.06,35.94 89.79,34.67 v89.79,32.13
  Bottom 0.254: v54.1,28.32 85.98,28.32 v89.79,32.13 | R33.E 98.55,33.66 121.92,33.66 123.44,35.18 123.44,69.47 122.15,70.76 UPLNK1.3
UP_CD  (via drill 0.41)
  Top 0.1: U3.46 49.19,42.12 49.02,42.29 48.51,42.29 v47.75,41.53
  Bottom 0.1: v47.75,41.53 47.75,40.89 48.13,40.51 50.55,40.51 50.93,40.89 50.93,43.81 57.53,50.42 57.53,54.86 58.42,55.75 90.17,55.75 110.24,75.82 118.34,75.82 UPLNK1.4
USB_CONN  (via drill 0.5)
  Top 0.254: U3.17 39.88,32.59 39.88,25.53 38.35,24 v26.16,24 | v13.46,22.73 6.18,15.46 R9.2
  Bottom 0.254: v26.16,24 14.73,24 v13.46,22.73
VBUS  (via drill 0.41, 0.5)
  Top 0.254: U3.58 43.95,46.34 v43.69,46.61 | v22.42,46.67 15.11,39.37 R12.1
  Bottom 0.254: v43.69,46.61 22.48,46.61 v22.42,46.67
VCC  (via drill 0.41, 0.5)  (1 unrouted)
  Top 0.1: R26.2 38.61,18.68 | 46.99,14.17 U6.16 | 45.59,9.53 45.61,9.51 | 44.96,9.53 44.96,9.52 | R28.2 56.81,74.3 60.83,74.3 61.59,75.06 61.59,84.71 60.58,85.72 X3.2 | U3.23 43.95,32.08 C7.1 | 32.77,18.67 R42.1 | R43.1 23.88,18.54 24.64,17.78 | C28.1 31.2,16.92 U10.8 30.1,13.72 29.84,13.46 C29.2
  Top 0.127: 38.61,18.68 38.61,16.38 40.74,14.25 U6.24 41.71,10.49 42.67,9.53 44.96,9.53 45.59,9.53 46.1,9.53 46.99,10.41 46.99,14.17 | 45.61,9.51 U6.7 | 44.96,9.52 U6.6
  Top 0.254: C5.2 U1.16 | L2.2 101.52,23.99 C24.A | 41.91,42.4 41.45,42.84 U3.63 41.45,45.92 40.77,46.61 38.21,46.61 C9.1 | 46.86,42.4 41.91,42.4 | C8.1 53.31,41.4 52.58,41.4 51.8,40.62 U3.43 50.38,40.64 46.86,40.64 | v48.9,66.67 50.59,68.37 U2.2 50.44,72.33 C6.1 50.29,77.33 R5.2 50.42,79.03 52.96,79.03 | 46.89,37.24 46.86,37.27 | 46.86,37.27 46.86,40.64 | 46.86,40.64 46.86,42.4 | 6.1,6.35 6.21,6.46 C15.1 6.18,10.18 R10.1 7.75,12.7 8.13,13.08 9.25,13.08 Q3.2 | C10.1 36.58,38.73 37.97,40.13 38.99,40.13 U3.7 40.25,40.12 41.91,41.78 41.91,42.39 41.91,42.4 | U3.49 48.45,42.99 47.88,42.42 46.89,42.42 | R26.2 38.56,18.67 35.56,18.67 | 32.64,18.67 25.53,18.67 24.64,17.78 22.61,15.75 v22.61,6.35 | 32.64,18.67 32.77,18.67 35.56,18.67 | C27.1 35.62,18.61 35.56,18.67 | C28.1 32.57,18.6 32.64,18.67 | U3.23 43.95,34.94 46.23,37.21 46.81,37.21 46.86,37.27 | 1.91,51.44 6.22,51.44 9.82,55.16 R27.1 23.84,53.89 25.02,52.7 26.54,52.7 | X3.1 X3.2 60.07,87.63 59.56,88.14 55.12,88.14 54.61,87.63 R36.2 53.43,85.69 52.96,85.22 52.96,82.3 | 52.96,79.03 52.96,82.3 | 52.96,79.03 R30.2 | R35.2 53,82.26 52.96,82.3 | U3.51 47.45,44.15 46.86,43.56 46.86,42.44 46.89,42.42 | 46.86,42.4 46.89,42.42 | v79.32,57.05 79.34,57.06 U$3.4
  Top 0.406: U1.16 3.83,72.15 1.78,70.1 1.78,51.44 | 1.78,51.44 1.78,9.4 4.83,6.35 6.1,6.35 v7.62,6.35 | U7.8 U7.7 U7.6 U7.5 | 1.78,51.44 1.91,51.44 | 26.54,52.7 U7.8 | U7.8 26.59,52.75 26.54,52.7 26.54,50.16
  Top 0.61: 68.11,26.73 64.79,23.41 64.79,13.53 62.74,11.47 62.74,3.81 60.71,1.78 27.18,1.78 v22.61,6.35 | 68.11,26.73 68.17,26.79 100.05,26.79 101.15,25.69 101.15,24.38 C24.A 101.09,27.87 101.09,44.45 99.66,45.63 R31.2 | 46.89,37.24 57.41,26.73 68.11,26.73 | 101.52,23.99 104,23.99 105.28,25.27 118.47,25.27 X5.5
  Bottom 0.254: U7.8 26.64,52.7 29.21,52.7 30.35,53.85 30.35,65.53 31.5,66.67 v48.9,66.67 59.18,56.39 78.66,56.39 v79.32,57.05
  Bottom 0.406: v7.62,6.35 v22.61,6.35
XTAL1
  Top 0.254: U3.62 41.95,46.07 39.15,48.87 XT2.PIN4 35.94,49.67 C13.1
XTAL2
  Top 0.254: U3.61 XT2.PIN1 42.47,49.65 46.01,49.65 C14.1

### Text on the board
tNames: OD1 | OD2 | C_DET | AUD_OUT | +12v | GND | FREQ | PTT | AUD_IN | ANLG | +12v | GN D | +3.3v | SCA | SDA | GND | PWM